# EAGLE design DRV2605 (EAGLE 9.1.3)

## Sheet 1 of 2
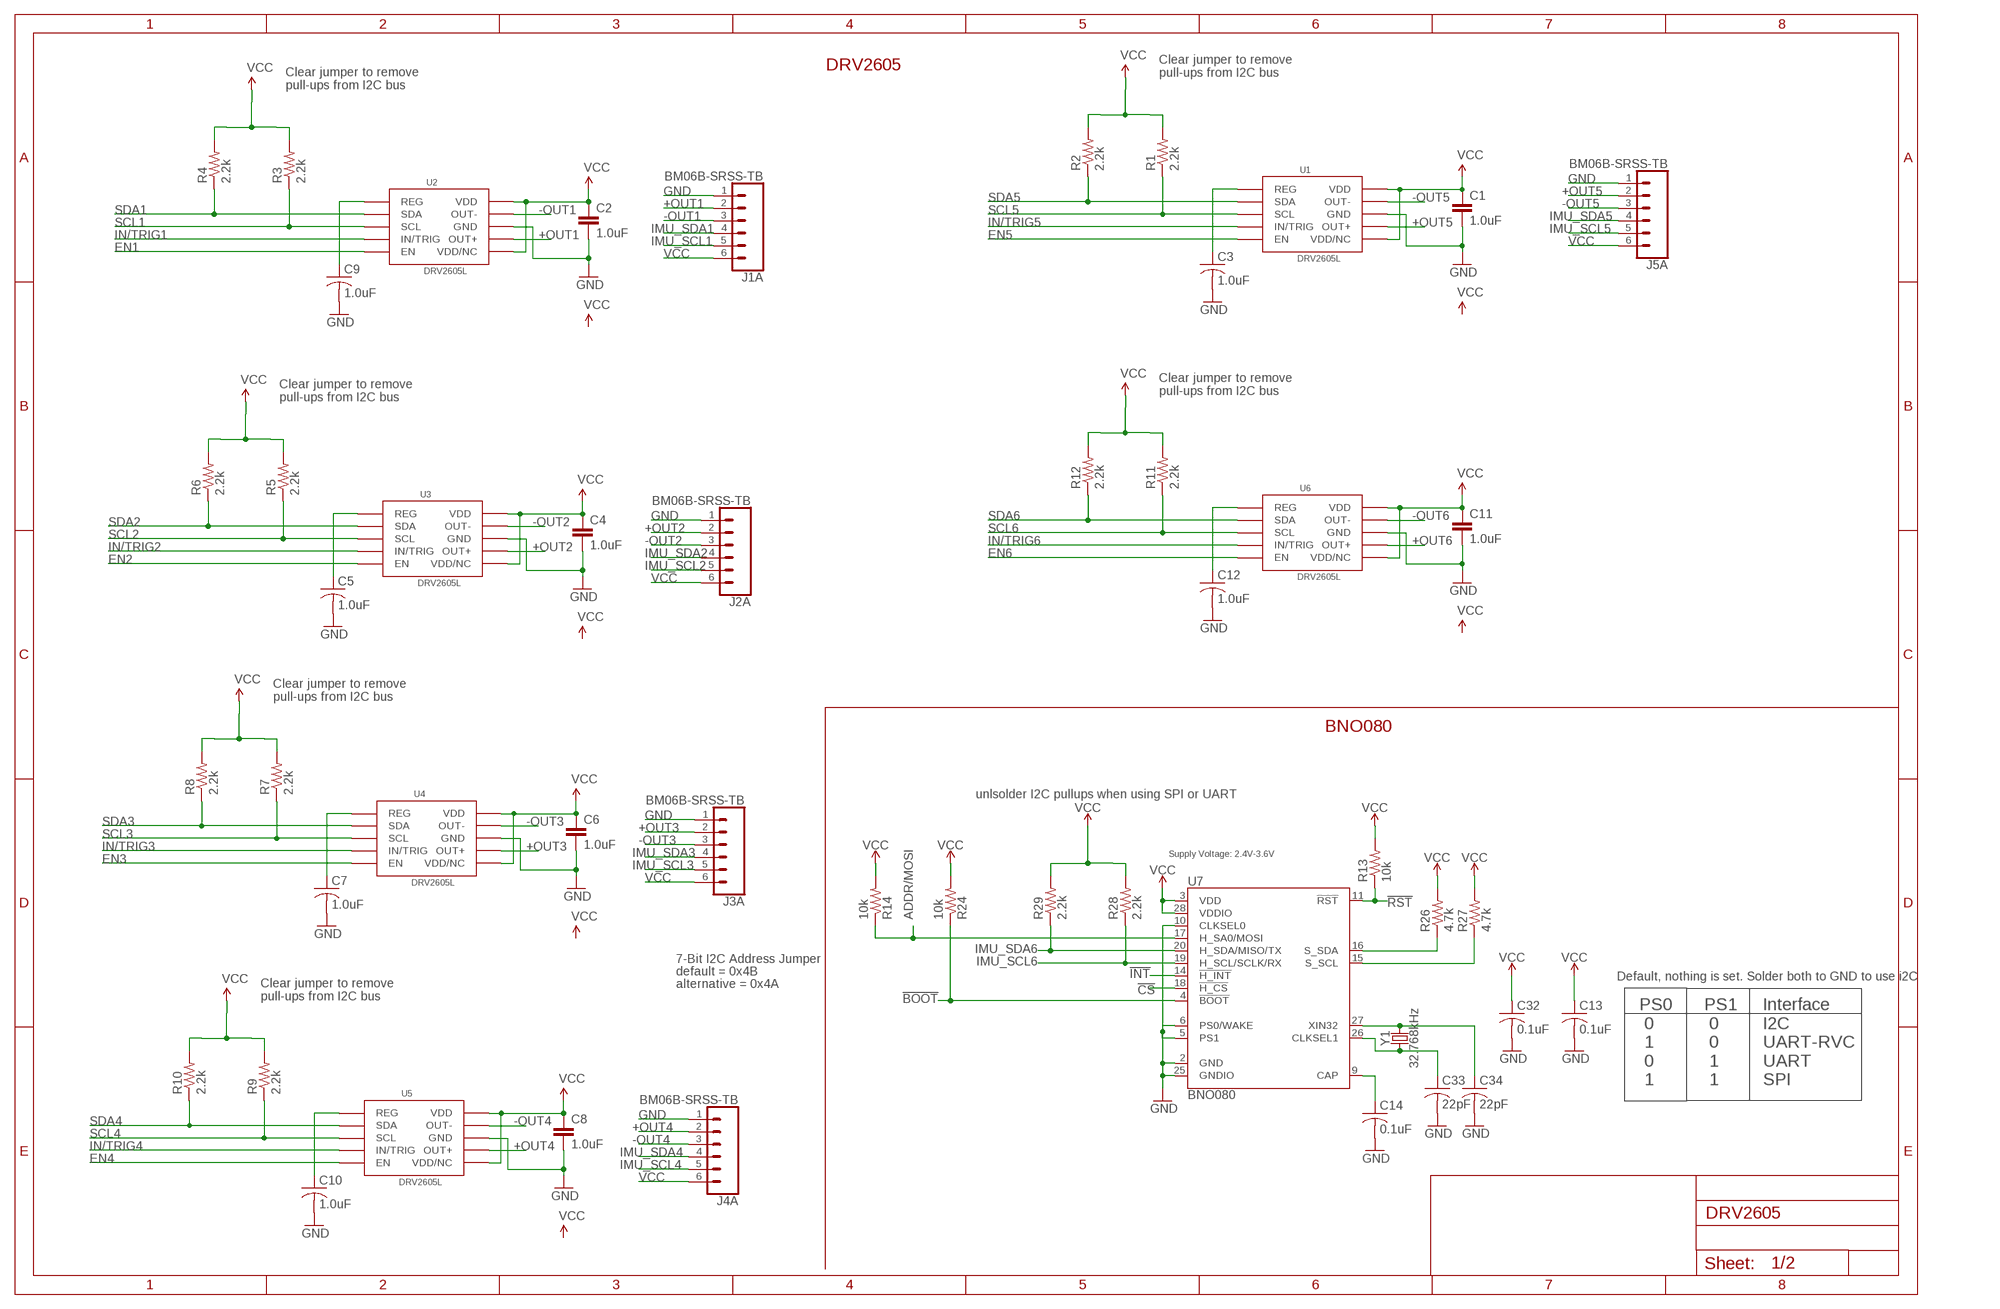
[diagram p0: schematic, sheet 1]

### Parts
C1  1.0uF  1.0UF-16V-10%(0402)  [0402-CAP]
C2  1.0uF  1.0UF-16V-10%(0402)  [0402-CAP]
C3  1.0uF  C-USC0402  [C0402]
C4  1.0uF  1.0UF-16V-10%(0402)  [0402-CAP]
C5  1.0uF  C-USC0402  [C0402]
C6  1.0uF  1.0UF-16V-10%(0402)  [0402-CAP]
C7  1.0uF  C-USC0402  [C0402]
C8  1.0uF  1.0UF-16V-10%(0402)  [0402-CAP]
C9  1.0uF  C-USC0402  [C0402]
C10  1.0uF  C-USC0402  [C0402]
C11  1.0uF  1.0UF-16V-10%(0402)  [0402-CAP]
C12  1.0uF  C-USC0402  [C0402]
C13  0.1uF  C-USC0402  [C0402]
C14  0.1uF  C-USC0402  [C0402]
C32  0.1uF  C-USC0402  [C0402]
C33  22pF  C-USC0402  [C0402]
C34  22pF  C-USC0402  [C0402]
J1  BM06B-SRSS-TB  JST_6_PIN_HORIZONTAL  [JST-6-SMD-HORI-1.0MM]
J2  BM06B-SRSS-TB  JST_6_PIN_HORIZONTAL  [JST-6-SMD-HORI-1.0MM]
J3  BM06B-SRSS-TB  JST_6_PIN_HORIZONTAL  [JST-6-SMD-HORI-1.0MM]
J4  BM06B-SRSS-TB  JST_6_PIN_HORIZONTAL  [JST-6-SMD-HORI-1.0MM]
J5  BM06B-SRSS-TB  JST_6_PIN_HORIZONTAL  [JST-6-SMD-HORI-1.0MM]
R1  2.2k  2.2KOHM-1/10W-1%(0603)  [0603-RES]
R2  2.2k  2.2KOHM-1/10W-1%(0603)  [0603-RES]
R3  2.2k  2.2KOHM-1/10W-1%(0603)  [0603-RES]
R4  2.2k  2.2KOHM-1/10W-1%(0603)  [0603-RES]
R5  2.2k  2.2KOHM-1/10W-1%(0603)  [0603-RES]
R6  2.2k  2.2KOHM-1/10W-1%(0603)  [0603-RES]
R7  2.2k  2.2KOHM-1/10W-1%(0603)  [0603-RES]
R8  2.2k  2.2KOHM-1/10W-1%(0603)  [0603-RES]
R9  2.2k  2.2KOHM-1/10W-1%(0603)  [0603-RES]
R10  2.2k  2.2KOHM-1/10W-1%(0603)  [0603-RES]
R11  2.2k  2.2KOHM-1/10W-1%(0603)  [0603-RES]
R12  2.2k  2.2KOHM-1/10W-1%(0603)  [0603-RES]
R13  10k  R-US_R0402  [R0402]
R14  10k  R-US_R0402  [R0402]
R24  10k  R-US_R0402  [R0402]
R26  4.7k  R-US_R0402  [R0402]
R27  4.7k  R-US_R0402  [R0402]
R28  2.2k  R-US_R0402  [R0402]
R29  2.2k  R-US_R0402  [R0402]
U1  DRV2605L  [VSSOP-10]
U2  DRV2605L  [VSSOP-10]
U3  DRV2605L  [VSSOP-10]
U4  DRV2605L  [VSSOP-10]
U5  DRV2605L  [VSSOP-10]
U6  DRV2605L  [VSSOP-10]
U7  BNO080  [LGA-28]
Y1  32.768kHz  CRYSTAL-32.768KHZSMD-3.2X1.5  [CRYSTAL-SMD-3.2X1.5MM]

### Nets
!BOOT: R24.1 U7.4(!BOOT)
!CS: U7.18(!H_CS)
!INT: U7.14(!H_INT)
!RST: R13.1 U7.11(!RST)
+OUT1: J1.2 U2.P$7(OUT+)
+OUT2: J2.2 U3.P$7(OUT+)
+OUT3: J3.2 U4.P$7(OUT+)
+OUT4: J4.2 U5.P$7(OUT+)
+OUT5: J5.2 U1.P$7(OUT+)
+OUT6: U6.P$7(OUT+) ; also sheet 2
-OUT1: J1.3 U2.P$9(OUT-)
-OUT2: J2.3 U3.P$9(OUT-)
-OUT3: J3.3 U4.P$9(OUT-)
-OUT4: J4.3 U5.P$9(OUT-)
-OUT5: J5.3 U1.P$9(OUT-)
-OUT6: U6.P$9(OUT-) ; also sheet 2
ADDR/MOSI: R14.1 U7.17(H_SA0/MOSI)
CAP: C14.1 U7.9(CAP)
EN1: U2.P$5(EN) ; also sheet 2
EN2: U3.P$5(EN) ; also sheet 2
EN3: U4.P$5(EN) ; also sheet 2
EN4: U5.P$5(EN) ; also sheet 2
EN5: U1.P$5(EN) ; also sheet 2
EN6: U6.P$5(EN) ; also sheet 2
GND: C1.2 C2.2 C3.2 C4.2 C5.2 C6.2 C7.2 C8.2 C9.2 C10.2 C11.2 C12.2 C13.2 C14.2 C32.2 C33.2 C34.2 J1.1 J2.1 J3.1 J4.1 J5.1 U1.P$8(GND) U2.P$8(GND) U3.P$8(GND) U4.P$8(GND) U5.P$8(GND) U6.P$8(GND) U7.2(GND) U7.5(PS1) U7.6(PS0/WAKE) U7.10(CLKSEL0) U7.25(GNDIO) ; also sheet 2
IMU_SCL1: J1.5 ; also sheet 2
IMU_SCL2: J2.5 ; also sheet 2
IMU_SCL3: J3.5 ; also sheet 2
IMU_SCL4: J4.5 ; also sheet 2
IMU_SCL5: J5.5 ; also sheet 2
IMU_SCL6: R28.1 U7.19(H_SCL/SCLK/RX) ; also sheet 2
IMU_SDA1: J1.4 ; also sheet 2
IMU_SDA2: J2.4 ; also sheet 2
IMU_SDA3: J3.4 ; also sheet 2
IMU_SDA4: J4.4 ; also sheet 2
IMU_SDA5: J5.4 ; also sheet 2
IMU_SDA6: R29.1 U7.20(H_SDA/MISO/TX) ; also sheet 2
IN/TRIG1: U2.P$4(IN/TRIG) ; also sheet 2
IN/TRIG2: U3.P$4(IN/TRIG) ; also sheet 2
IN/TRIG3: U4.P$4(IN/TRIG) ; also sheet 2
IN/TRIG4: U5.P$4(IN/TRIG) ; also sheet 2
IN/TRIG5: U1.P$4(IN/TRIG) ; also sheet 2
IN/TRIG6: U6.P$4(IN/TRIG) ; also sheet 2
N$1: C3.1 U1.P$1(REG)
N$4: C12.1 U6.P$1(REG)
N$7: C34.1 U7.27(XIN32) Y1.P$2
N$10: C9.1 U2.P$1(REG)
N$13: C5.1 U3.P$1(REG)
N$14: C33.1 U7.26(CLKSEL1) Y1.P$1
N$16: C7.1 U4.P$1(REG)
N$19: C10.1 U5.P$1(REG)
S_SCL: R27.1 U7.15(S_SCL)
S_SDA: R26.1 U7.16(S_SDA)
SCL1: R3.1 U2.P$2(SCL) ; also sheet 2
SCL2: R5.1 U3.P$2(SCL) ; also sheet 2
SCL3: R7.1 U4.P$2(SCL) ; also sheet 2
SCL4: R9.1 U5.P$2(SCL) ; also sheet 2
SCL5: R1.1 U1.P$2(SCL) ; also sheet 2
SCL6: R11.1 U6.P$2(SCL) ; also sheet 2
SDA1: R4.1 U2.P$3(SDA) ; also sheet 2
SDA2: R6.1 U3.P$3(SDA) ; also sheet 2
SDA3: R8.1 U4.P$3(SDA) ; also sheet 2
SDA4: R10.1 U5.P$3(SDA) ; also sheet 2
SDA5: R2.1 U1.P$3(SDA) ; also sheet 2
SDA6: R12.1 U6.P$3(SDA) ; also sheet 2
VCC: C1.1 C2.1 C4.1 C6.1 C8.1 C11.1 C13.1 C32.1 J1.6 J2.6 J3.6 J4.6 J5.6 R1.2 R2.2 R3.2 R4.2 R5.2 R6.2 R7.2 R8.2 R9.2 R10.2 R11.2 R12.2 R13.2 R14.2 R24.2 R26.2 R27.2 R28.2 R29.2 U1.P$6(VDD/NC) U1.P$10(VDD) U2.P$6(VDD/NC) U2.P$10(VDD) U3.P$6(VDD/NC) U3.P$10(VDD) U4.P$6(VDD/NC) U4.P$10(VDD) U5.P$6(VDD/NC) U5.P$10(VDD) U6.P$6(VDD/NC) U6.P$10(VDD) U7.3(VDD) U7.28(VDDIO) ; also sheet 2
Unconnected: J1.M1 J1.M2 J2.M1 J2.M2 J3.M1 J3.M2 J4.M1 J4.M2 J5.M1 J5.M2

### Notes on the sheet
- DRV2605
- Clear jumper to remove
  pull-ups from I2C bus
- Clear jumper to remove
  pull-ups from I2C bus
- Clear jumper to remove
  pull-ups from I2C bus
- Clear jumper to remove
  pull-ups from I2C bus
- Clear jumper to remove
  pull-ups from I2C bus
- BNO080
- unlsolder I2C pullups when using SPI or UART
- Supply Voltage: 2.4V-3.6V
- 7-Bit I2C Address Jumper
- default = 0x4B
- Default, nothing is set. Solder both to GND to use i2C
- alternative = 0x4A
- Clear jumper to remove
  pull-ups from I2C bus
- PS0
   0
   1
   0
   1
- PS1
   0
   0
   1
   1
- Interface
  I2C
  UART-RVC
  UART
  SPI

## Sheet 2 of 2
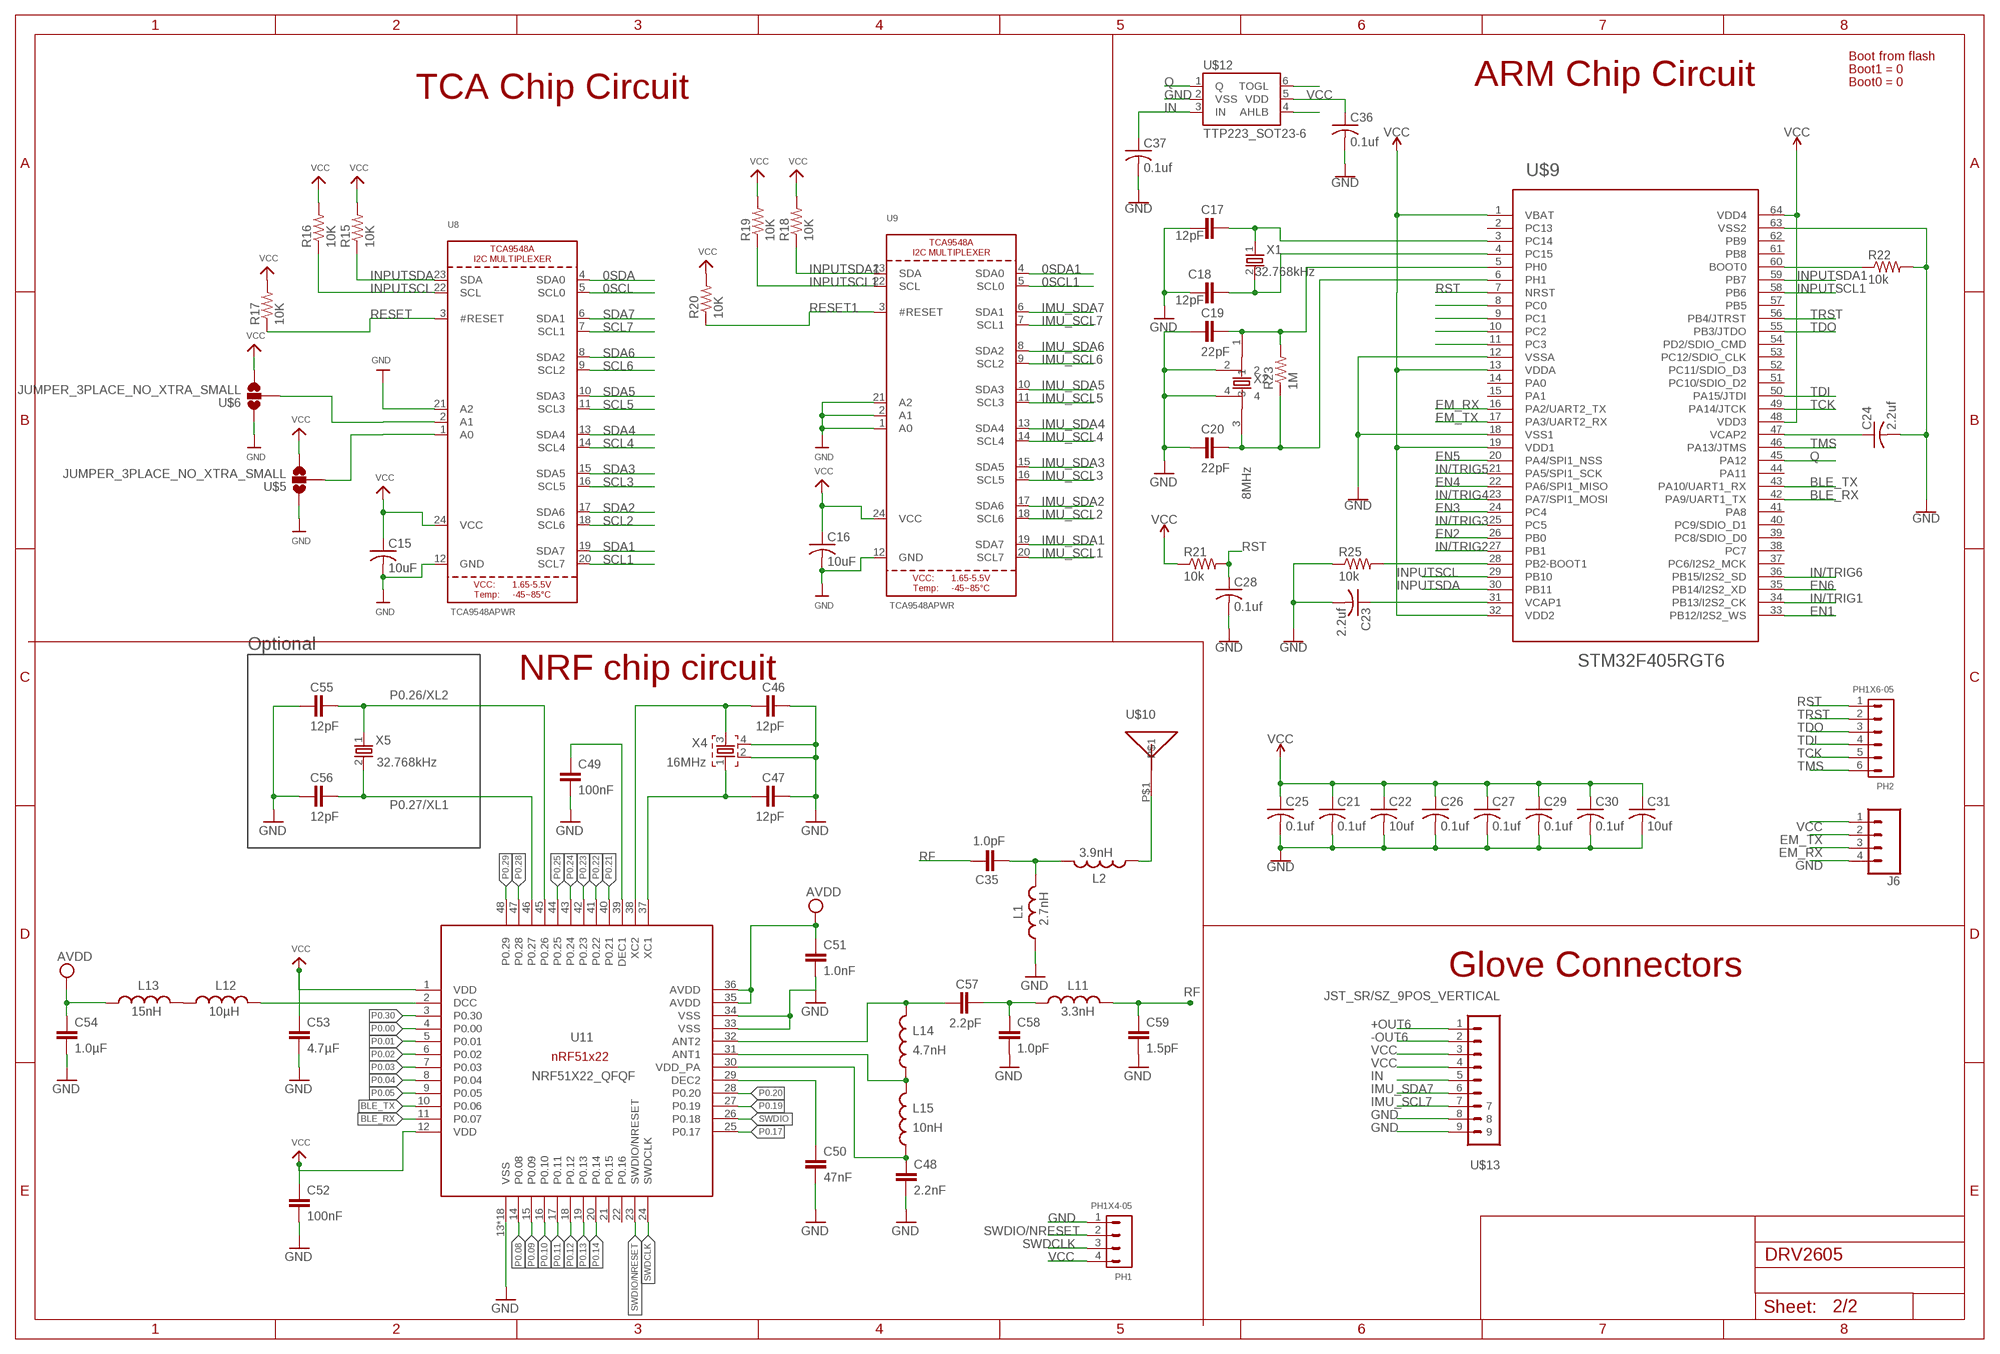
[diagram p1: schematic, sheet 2]

### Parts
C15  10uF  C-USC0402  [C0402]
C16  10uF  C-USC0402  [C0402]
C17  12pF  CAPACITOR_0402_N  [RESC0402_N]
C18  12pF  CAPACITOR_0402_N  [RESC0402_N]
C19  22pF  CAPACITOR_0402_N  [RESC0402_N]
C20  22pF  CAPACITOR_0402_N  [RESC0402_N]
C21  0.1uf  C-USC0402  [C0402]
C22  10uf  C-USC0402  [C0402]
C23  2.2uf  C-USC0402  [C0402]
C24  2.2uf  C-USC0402  [C0402]
C25  0.1uf  C-USC0402  [C0402]
C26  0.1uf  C-USC0402  [C0402]
C27  0.1uf  C-USC0402  [C0402]
C28  0.1uf  C-USC0402  [C0402]
C29  0.1uf  C-USC0402  [C0402]
C30  0.1uf  C-USC0402  [C0402]
C31  10uf  C-USC0402  [C0402]
C35  1.0pF  CAPACITOR_0402_N  [RESC0402_N]
C36  0.1uf  C-USC0402  [C0402]
C37  0.1uf  C-USC0402  [C0402]
C46  12pF  CAPACITOR_0402_N  [RESC0402_N]
C47  12pF  CAPACITOR_0402_N  [RESC0402_N]
C48  2.2nF  CAPACITOR_0402_N  [RESC0402_N]
C49  100nF  CAPACITOR_0402_N  [RESC0402_N]
C50  47nF  CAPACITOR_0402_N  [RESC0402_N]
C51  1.0nF  CAPACITOR_0402_N  [RESC0402_N]
C52  100nF  CAPACITOR_0402_N  [RESC0402_N]
C53  4.7µF  CAPACITOR_0603_N  [RESC0603_N]
C54  1.0µF  CAPACITOR_0603_N  [RESC0603_N]
C55  12pF  CAPACITOR_0402_N  [RESC0402_N]
C56  12pF  CAPACITOR_0402_N  [RESC0402_N]
C57  2.2pF  CAPACITOR_0402_N  [RESC0402_N]
C58  1.0pF  CAPACITOR_0402_N  [RESC0402_N]
C59  1.5pF  CAPACITOR_0402_N  [RESC0402_N]
J6  CONN_04  [1X04]
L1  2.7nH  INDUCTOR_0402_N  [RESC0402_N]
L2  3.9nH  INDUCTOR_0402_N  [RESC0402_N]
L11  3.3nH  INDUCTOR_0402_N  [RESC0402_N]
L12  10µH  INDUCTOR_0603_N  [RESC0603_N]
L13  15nH  INDUCTOR_0402_N  [RESC0402_N]
L14  4.7nH  INDUCTOR_0402_N  [RESC0402_N]
L15  10nH  INDUCTOR_0402_N  [RESC0402_N]
PH1  PH1X4-05  [PH005-1-4]
PH2  PH1X6-05  [PH005-1-6]
R15  10K  R-US_R0402  [R0402]
R16  10K  R-US_R0402  [R0402]
R17  10K  R-US_R0402  [R0402]
R18  10K  R-US_R0402  [R0402]
R19  10K  R-US_R0402  [R0402]
R20  10K  R-US_R0402  [R0402]
R21  10k  R-US_R0402  [R0402]
R22  10k  R-US_R0402  [R0402]
R23  1M  R-US_R0402  [R0402]
R25  10k  R-US_R0402  [R0402]
U8  TCA9548APWR  TCA9548A  [TSSOP24]
U9  TCA9548APWR  TCA9548A  [TSSOP24]
U11  NRF51X22_QFQF  [QFN40P600X600X90-48_N]
U$5  JUMPER_3PLACE_NO_XTRA_SMALL  [XTRA_SMALL_JUMPER_3_NO]
U$6  JUMPER_3PLACE_NO_XTRA_SMALL  [XTRA_SMALL_JUMPER_3_NO]
U$9  STM32F405RGT6  STM32F405RG  [TQFP64]
U$10  ANT_2450AT18B100E  [2450AT18B100E]
U$12  TTP223_SOT23-6  [SOT23-6]
U$13  JST_SR/SZ_9POS_VERTICAL  [JST_SR/SZ_VERTICA_9POS]
X1  32.768kHz  XTAL_32KHZ  [XTAL_3215_N]
X2  8MHz  CRYSTAL_5X3.2MM_4PAD  [CRYSTAL-SMD-5X3.2-4PAD]
X4  16MHz  XTAL_32MHZ  [BT-XTAL_2016_N]
X5  32.768kHz  XTAL_32KHZ  [XTAL_3215_N]

### Nets
0SCL: U8.5(SCL0)
0SCL1: U9.5(SCL0)
0SDA: U8.4(SDA0)
0SDA1: U9.4(SDA0)
+OUT6: U$13.1 ; also sheet 1
-OUT6: U$13.2 ; also sheet 1
AVDD: C51.1 C54.1 L13.1 U11.35(AVDD) U11.36(AVDD)
BLE_RX: U11.11(P0.07) U$9.42(PA9/UART1_TX)
BLE_TX: U11.10(P0.06) U$9.43(PA10/UART1_RX)
EM_RX: J6.3 U$9.16(PA2/UART2_TX)
EM_TX: J6.2 U$9.17(PA3/UART2_RX)
EN1: U$9.33(PB12/I2S2_WS) ; also sheet 1
EN2: U$9.26(PB0) ; also sheet 1
EN3: U$9.24(PC4) ; also sheet 1
EN4: U$9.22(PA6/SPI1_MISO) ; also sheet 1
EN5: U$9.20(PA4/SPI1_NSS) ; also sheet 1
EN6: U$9.35(PB14/I2S2_XD) ; also sheet 1
GND: C15.2 C16.2 C17.1 C18.1 C19.1 C20.1 C21.2 C22.2 C23.2 C24.2 C25.2 C26.2 C27.2 C28.2 C29.2 C30.2 C31.2 C36.2 C37.2 C46.2 C47.2 C48.2 C49.2 C50.2 C51.2 C52.2 C53.2 C54.2 C55.1 C56.1 C58.2 C59.2 J6.4 L1.1 PH1.1 R22.2 R25.1 U8.12(GND) U8.21(A2) U9.1(A0) U9.2(A1) U9.12(GND) U9.21(A2) U11.13(VSS) U11.33(VSS) U11.34(VSS) U11.PAD(VSS) U11.PAD@VIA01(VSS) U11.PAD@VIA02(VSS) U11.PAD@VIA03(VSS) U11.PAD@VIA04(VSS) U11.PAD@VIA05(VSS) U11.PAD@VIA06(VSS) U11.PAD@VIA07(VSS) U11.PAD@VIA08(VSS) U11.PAD@VIA09(VSS) U11.PAD@VIA10(VSS) U11.PAD@VIA11(VSS) U11.PAD@VIA12(VSS) U11.PAD@VIA13(VSS) U11.PAD@VIA14(VSS) U11.PAD@VIA15(VSS) U11.PAD@VIA16(VSS) U$5.1 U$6.1 U$9.12(VSSA) U$9.18(VSS1) U$9.63(VSS2) U$12.2(VSS) U$13.8 U$13.9 X2.2 X2.4 X4.2 X4.4 ; also sheet 1
IMU_SCL1: U9.20(SCL7) ; also sheet 1
IMU_SCL2: U9.18(SCL6) ; also sheet 1
IMU_SCL3: U9.16(SCL5) ; also sheet 1
IMU_SCL4: U9.14(SCL4) ; also sheet 1
IMU_SCL5: U9.11(SCL3) ; also sheet 1
IMU_SCL6: U9.9(SCL2) ; also sheet 1
IMU_SCL7: U9.7(SCL1) U$13.7
IMU_SDA1: U9.19(SDA7) ; also sheet 1
IMU_SDA2: U9.17(SDA6) ; also sheet 1
IMU_SDA3: U9.15(SDA5) ; also sheet 1
IMU_SDA4: U9.13(SDA4) ; also sheet 1
IMU_SDA5: U9.10(SDA3) ; also sheet 1
IMU_SDA6: U9.8(SDA2) ; also sheet 1
IMU_SDA7: U9.6(SDA1) U$13.6
IN: C37.1 U$12.3(IN) U$13.5
IN/TRIG1: U$9.34(PB13/I2S2_CK) ; also sheet 1
IN/TRIG2: U$9.27(PB1) ; also sheet 1
IN/TRIG3: U$9.25(PC5) ; also sheet 1
IN/TRIG4: U$9.23(PA7/SPI1_MOSI) ; also sheet 1
IN/TRIG5: U$9.21(PA5/SPI1_SCK) ; also sheet 1
IN/TRIG6: U$9.36(PB15/I2S2_SD) ; also sheet 1
INPUTSCL: R16.1 U8.22(SCL) U$9.29(PB10)
INPUTSCL1: R19.1 U9.22(SCL) U$9.58(PB6)
INPUTSDA: R15.1 U8.23(SDA) U$9.30(PB11)
INPUTSDA1: R18.1 U9.23(SDA) U$9.59(PB7)
N$2: R25.2 U$9.28(PB2-BOOT1)
N$3: R22.1 U$9.60(BOOT0)
N$5: C23.1 U$9.31(VCAP1)
N$6: C24.1 U$9.47(VCAP2)
N$8: U$9.8(PC0)
N$9: U$9.9(PC1)
N$11: U$9.10(PC2)
N$12: U$9.11(PC3)
N$15: C35.1 L1.2 L2.2
N$17: L2.1 U$10.P$1
N$22: U$12.6(TOGL)
N$24: U$12.4(AHLB)
N$27: U8.1(A0) U$5.2
N$30: U8.2(A1) U$6.2
N$33: C46.1 U11.38(XC2) X4.3
N$34: L12.1 L13.2
N$35: L12.2 U11.2(DCC)
N$36: C50.1 U11.29(DEC2)
N$37: C49.1 U11.39(DEC1)
N$38: L14.1 L15.2 U11.31(ANT1)
N$39: C48.1 L15.1 U11.30(VDD_PA)
N$40: C57.1 L14.2 U11.32(ANT2)
N$41: C57.2 C58.1 L11.1
P0.00: U11.4(P0.00)
P0.01: U11.5(P0.01)
P0.02: U11.6(P0.02)
P0.03: U11.7(P0.03)
P0.04: U11.8(P0.04)
P0.05: U11.9(P0.05)
P0.08: U11.14(P0.08)
P0.09: U11.15(P0.09)
P0.10: U11.16(P0.10)
P0.11: U11.17(P0.11)
P0.12: U11.18(P0.12)
P0.13: U11.19(P0.13)
P0.14: U11.20(P0.14)
P0.17: U11.25(P0.17)
P0.19: U11.27(P0.19)
P0.20: U11.28(P0.20)
P0.21: U11.40(P0.21)
P0.22: U11.41(P0.22)
P0.23: U11.42(P0.23)
P0.24: U11.43(P0.24)
P0.25: U11.44(P0.25)
P0.26/XL2: C55.2 U11.45(P0.26) X5.1
P0.27/XL1: C56.2 U11.46(P0.27) X5.2
P0.28: U11.47(P0.28)
P0.29: U11.48(P0.29)
P0.30: U11.3(P0.30)
PC14: C17.2 U$9.3(PC14) X1.1
PC15: C18.2 U$9.4(PC15) X1.2
PH0: C19.2 R23.2 U$9.5(PH0) X2.1
PH1: C20.2 R23.1 U$9.6(PH1) X2.3
Q: U$9.45(PA12) U$12.1(Q)
RESET: R17.1 U8.3(#RESET)
RESET1: R20.1 U9.3(#RESET)
RF: C35.2 C59.1 L11.2
RST: C28.1 PH2.1 R21.2 U$9.7(NRST)
SCL1: U8.20(SCL7) ; also sheet 1
SCL2: U8.18(SCL6) ; also sheet 1
SCL3: U8.16(SCL5) ; also sheet 1
SCL4: U8.14(SCL4) ; also sheet 1
SCL5: U8.11(SCL3) ; also sheet 1
SCL6: U8.9(SCL2) ; also sheet 1
SCL7: U8.7(SCL1)
SDA1: U8.19(SDA7) ; also sheet 1
SDA2: U8.17(SDA6) ; also sheet 1
SDA3: U8.15(SDA5) ; also sheet 1
SDA4: U8.13(SDA4) ; also sheet 1
SDA5: U8.10(SDA3) ; also sheet 1
SDA6: U8.8(SDA2) ; also sheet 1
SDA7: U8.6(SDA1)
SWDCLK: PH1.3 U11.24(SWDCLK)
SWDIO: U11.26(P0.18)
SWDIO/NRESET: PH1.2 U11.23(SWDIO/NRESET)
TCK: PH2.5 U$9.49(PA14/JTCK)
TDI: PH2.4 U$9.50(PA15/JTDI)
TDO: PH2.3 U$9.55(PB3/JTDO)
TMS: PH2.6 U$9.46(PA13/JTMS)
TRST: PH2.2 U$9.56(PB4/JTRST)
VCC: C15.1 C16.1 C21.1 C22.1 C25.1 C26.1 C27.1 C29.1 C30.1 C31.1 C36.1 C52.1 C53.1 J6.1 PH1.4 R15.2 R16.2 R17.2 R18.2 R19.2 R20.2 R21.1 U8.24(VCC) U9.24(VCC) U11.1(VDD) U11.12(VDD) U$5.3 U$6.3 U$9.1(VBAT) U$9.13(VDDA) U$9.19(VDD1) U$9.32(VDD2) U$9.48(VDD3) U$9.64(VDD4) U$12.5(VDD) U$13.3 U$13.4 ; also sheet 1
X2: C47.1 U11.37(XC1) X4.1
Unconnected: U11.21(P0.15) U11.22(P0.16) U$9.2(PC13) U$9.14(PA0) U$9.15(PA1) U$9.37(PC6/I2S2_MCK) U$9.38(PC7) U$9.39(PC8/SDIO_D0) U$9.40(PC9/SDIO_D1) U$9.41(PA8) U$9.44(PA11) U$9.51(PC10/SDIO_D2) U$9.52(PC11/SDIO_D3) U$9.53(PC12/SDIO_CLK) U$9.54(PD2/SDIO_CMD) U$9.57(PB5) U$9.61(PB8) U$9.62(PB9)

### Notes on the sheet
- Boot from flash
- Boot1 = 0
- ARM Chip Circuit | Boot0 = 0
- TCA Chip Circuit
- Optional
- NRF chip circuit
- Glove Connectors

## Library data of the parts
C1 C2 C4 C6 C8 C11 = SparkFun-Capacitors:1.0UF-16V-10%(0402); PROD_ID: CAP-12417
C3 C5 C7 C9 C10 C12-C14 C21-C34 C36 C37 = rcl:C-US: CAPACITOR, American symbol; SPICEPREFIX: C
C15 C16 = resistor:C-US: CAPACITOR, American symbol
C17-C20 C35 C46-C59 = Nordic_nRF:CAPACITOR: Generic chip capacitor
J1-J5 = SparkFun-Connectors:JST_6_PIN_HORIZONTAL: JST 6 pin horizontal connector JST-SH type. Here is the connector we sell at SparkFun: name <link> (XXX-00000) Datasheet <http://www.sparkfun.com/datasheets/GPS/EM406-SMDConnector-eSH.pdf> It was used on these SparkFun products: name <link> (XXX-00000) name <link> (XXX-00000); PROD_ID: XXX-00000
J6 = SparkFun-Connectors:CONN_04: Multi connection point. Often used as Generic Header-pin footprint for 0.1 inch spaced/style header connections On any of the 0.1 inch spaced packages, you can populate with these: Break Away Headers - Straight <https://www.sparkfun.com/products/116> (PRT-00116) Break Away Male Headers - Right Angle <https://www.sparkfun.com/products/553> (PRT-00553) Female Headers <https://www.sparkfun.com/products/115> (PRT-00115) Break Away Headers - Machine Pin <https://www.sparkfun.com/products/117> (PRT-00117) Break Away Female Headers - Swiss Machine Pin <https://www.sparkfun.com/products/743> (PRT-00743) For SCREWTERMINALS and SPRING TERMINALS visit here: Screw Terimnals on SparkFun.com <https://www.sparkfun.com/search/results?term=Screw+Terminals> (5mm/3.5mm/2.54mm spacing) This device is also useful as a general connection point to wire up your design to another part of your project. Our various solder wires solder well into these plated through hole pads. Hook-Up Wire - Assortment (Stranded, 22 AWG) <https://www.sparkfun.com/products/11375> (PRT-11375) Hook-Up Wire - Assortment (Solid Core, 22 AWG) <https://www.sparkfun.com/products/11367> (PRT-11367) View the entire wire category on our website here <https://www.sparkfun.com/categories/141> Special notes: Molex polarized connector foot print use with SKU : PRT-08231 with associated crimp pins and housings. 1MM SMD Version SKU: PRT-10208; PROD_ID: CONN-09696
L1 L2 L11-L15 = Nordic_nRF:INDUCTOR: Generic chip inductor
PH1 = pel_hdr:PH1X4
PH2 = pel_hdr:PH1X6
R1-R12 = SparkFun-Resistors:2.2KOHM-1/10W-1%(0603): RES-08272; PROD_ID: RES-08272
R13-R20 R24 R26-R29 = rcl:R-US_: RESISTOR, American symbol; SPICEPREFIX: R
R21-R23 R25 = resistor:R-US_: RESISTOR, American symbol
U1-U6 = SparkFun-PowerIC:DRV2605L; PROD_ID: IC-13504
U7 = SparkFun-IC-Special-Function:BNO080: Hillcrest Labs BNO080 - High Precision IMU (VR) The VR IMU uses the impressive BNO080 IMU. This IC has a combination triple axis accelerometer/gyro/magnetometer packaged with an ARM Cortex M0+ running powerful algorithms. The BNO080 Inertial Measurement Unit (IMU) produces accurate rotation vector headings, excellently suited for VR and other heading applications with a static rotation error of 2 degrees or less. It’s what we’ve been waiting for: all the sensor data is combined and drift corrected into meaningful, accurate IMU information. SparkFun Products: VR IMU (BNO080) <https://www.sparkfun.com/products/14618>; PROD_ID: SEN-13947
U8 U9 = microbuilder:TCA9548A: TCA9548A I2C Multiplexer
U11 = Nordic_nRF:NRF51X22_QF: nRF51x22 For devices: nRF51422 nRF51822 Features Single chip, highly flexible, 2.4 GHz multi-protocol device 32-bit ARM Cortex M0 CPU core 256kB/128kB flash + 32kB/16kB RAM Supports Bluetooth low energy protocol stacks Thread safe and run-time protected Event driven API On air compatible with nRF24L series 3 data rates (2Mbps/1Mbps/250kbps) +4dBm output power -93dBm sensitivity, Bluetooth low energy PPI system for maximum power-efficient applications and code simplification Flexible power management system with automatic power management of each peripheral Configurable I/O mapping for analog and digital I/O Applications Mobile phone accessories Wearables Beacons Rezence wireless charging monitoring PC peripherals Consumer Electronics (CE) remote controls Proximity/Alert sensors Smart Home Sports, fitness and healthcare sensors Smart RF tags Toys and electronic games Intelligent domestic appliances Industrial and commercial sensors Lighting
U$5 U$6 = yhtomit_jumpers:JUMPER_3PLACE_NO_XTRA_SMALL
U$9 = SparkFun-IC-Microcontroller:STM32F405RG: STM32F405RGT6 ARM DSP Chip used on the WAV Trigger board. IC MCU 32BIT 1MB FLASH 64LQFP Datasheet <https://cdn.sparkfun.com/datasheets/Widgets/STM32F405RGT6.pdf> SparkFun Products WAV Trigger <https://www.sparkfun.com/products/13660> (WIG-13660); PROD_ID: IC-11709
U$10 = Johanson_antennas:ANT_2450AT18B100E
U$12 = yhtomit_ICs:TTP223_SOT23-6
U$13 = yhtomit_connectors:JST_SR/SZ_9POS_VERTICAL
X1 X5 = Nordic_nRF:XTAL_32KHZ
X2 = yhtomit_XTAL:CRYSTAL_5X3.2MM_4PAD
X4 = Nordic_nRF:XTAL_32MHZ
Y1 = SparkFun-Clocks:CRYSTAL-32.768KHZ: 32.768kHz Crystal Frequency: 32.768kHz Frequency Stability: ±20ppm Load Capacitance: 12.5pF (PTH-2X6 & SMD-3.2X1.5), 6pF (SMD-2X6) SparkFun Products: SparkFun BigTime Watch Kit <https://www.sparkfun.com/products/11734> SparkFun nRF52832 Breakout <https://www.sparkfun.com/products/13990> SparkFun Real Time Clock Module <https://www.sparkfun.com/products/12708>; PROD_ID: XTAL-13062

## Net classes
1 vcc: width 0.152 mm
2 RF: clearance 0.508 mm

## Board
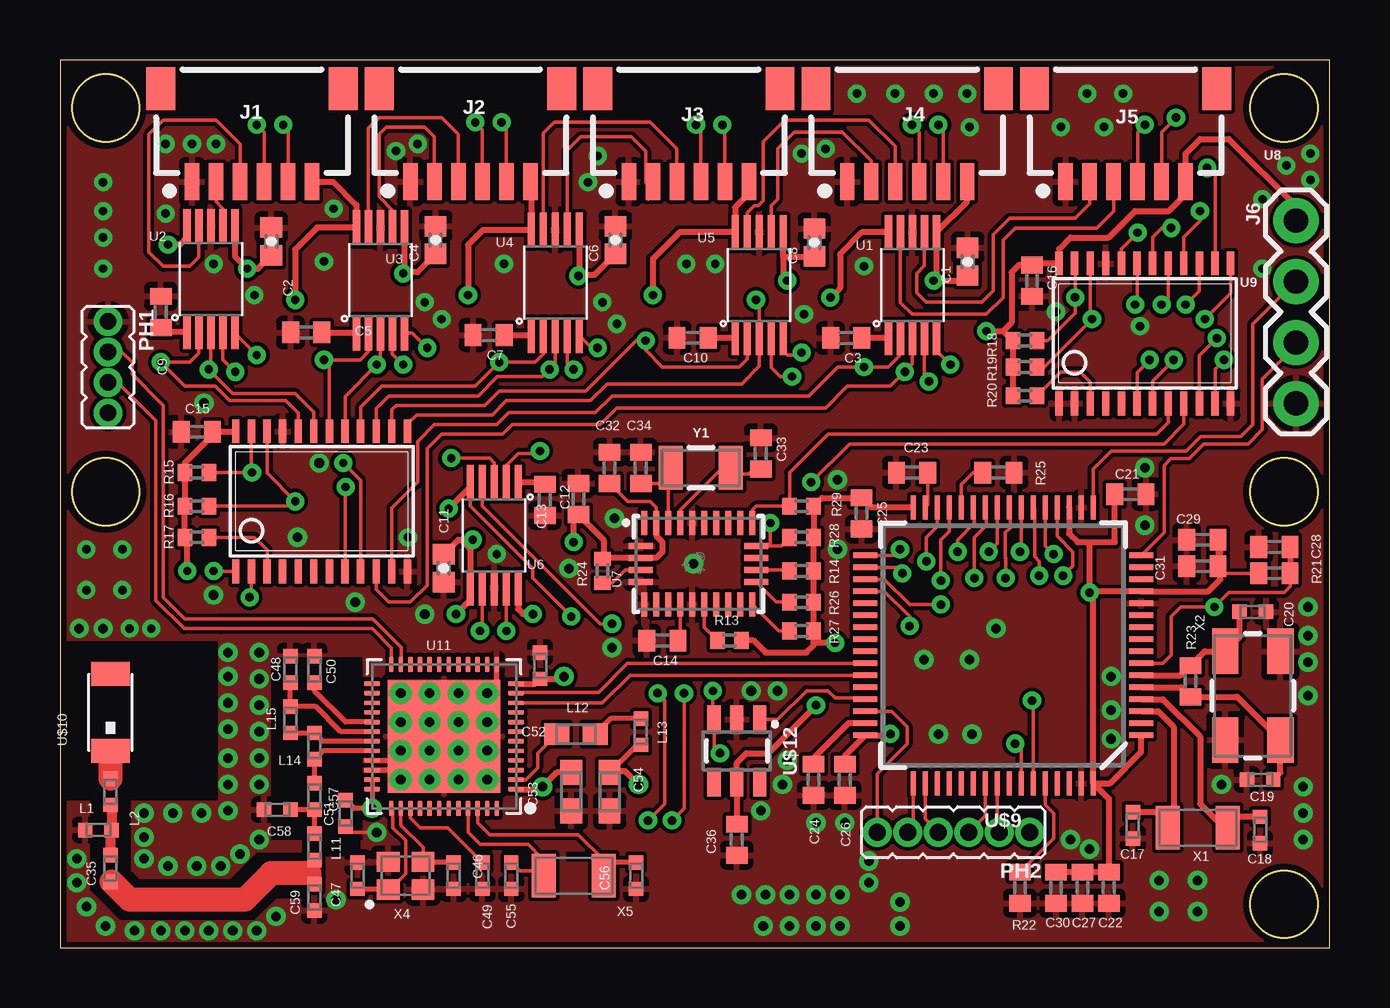
[diagram p2: board, top side]
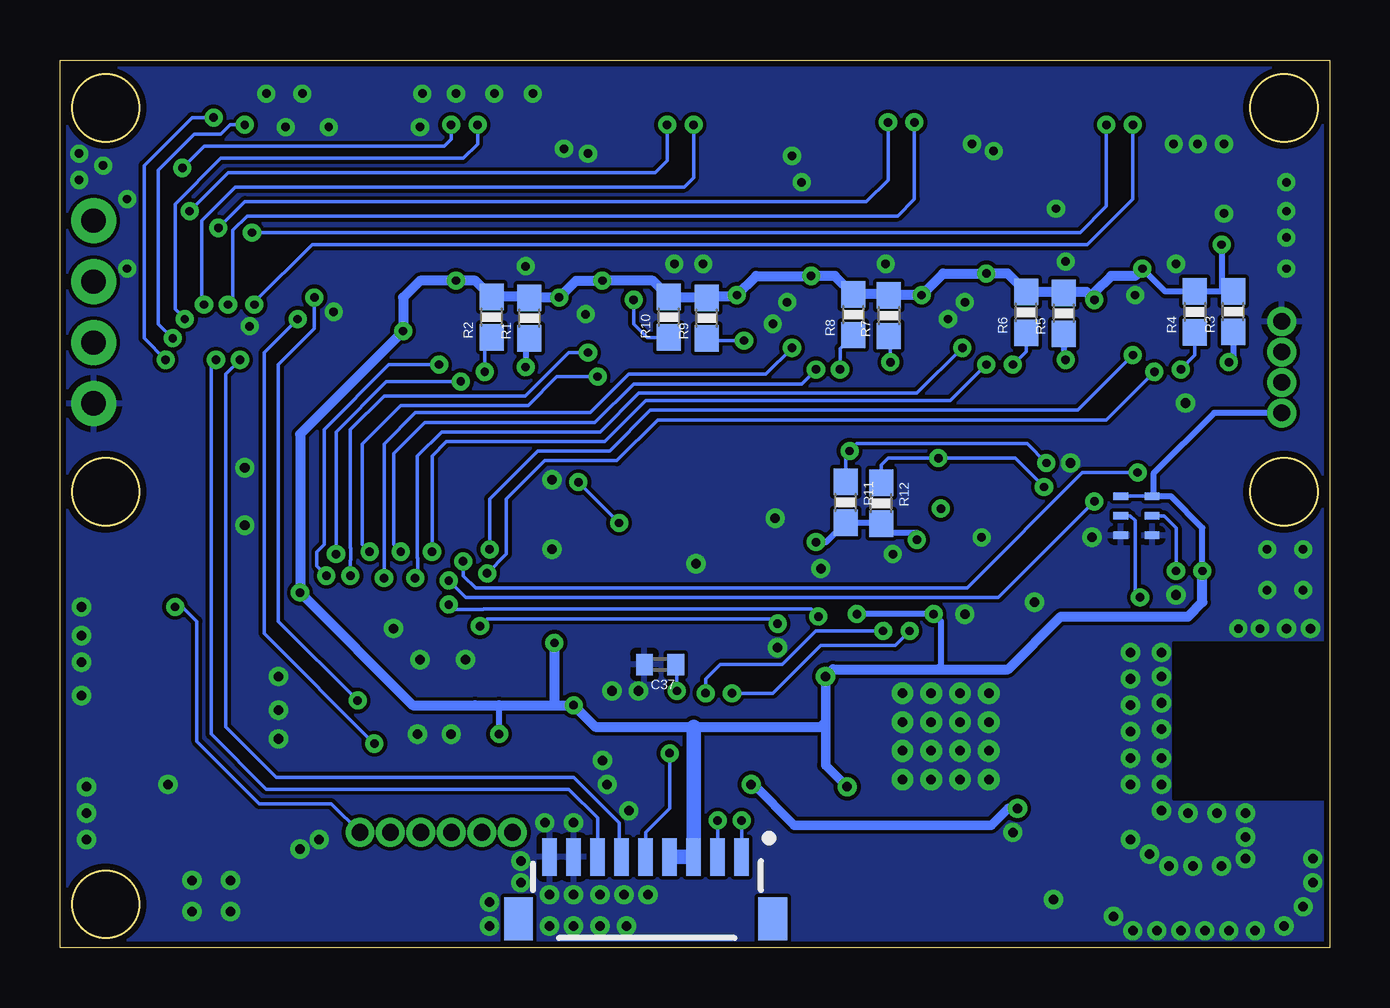
[diagram p3: board, bottom side, seen from below]

Size 52.9 x 37 mm. Coordinates in mm from the lower left corner, seen from the top.
Outline: 0,0 52.9,0 52.9,37 0,37 0,0
Outline: circle at 51,35 radius 1.4
Outline: circle at 51,1.8 radius 1.4
Outline: circle at 1.9,19 radius 1.4
Outline: circle at 1.9,35 radius 1.4
Outline: circle at 51,19 radius 1.4
Copper layers (1*16): Top 0.035mm / dielectric 1.5mm / Bottom 0.035mm
Design rules "default *": minimum track width 6mil, minimum drill 0.35mm, track to track 6mil, track to pad 6mil, pad to pad 6mil, via to via 6mil, smd to smd 6mil, copper to edge 10mil, drill to drill 6mil, minimum pad ring 10mil, minimum via ring 8mil, stop-mask expansion 4mil, vias tented up to drill 0mil, thermal gap 10mil
tRestrict: area 8.8,4.5 to 12.6,12.1; area 12.8,7.5 to 13.2,7.7; area 10.9,3.8 to 12.5,4.5; area 10.1,1.7 to 10.3,2.6; area 10.1,3.7 to 10.3,4.5; area 21.1,3.6 to 21.9,4; area 0.2,6.2 to 6.5,12.7; area 1.3,2.4 to 2.9,6.1; area 1.3,1.2 to 10.1,3.9
bRestrict: area 0.2,6.2 to 6.5,12.7

### Footprints (pad centres in the part's own frame; a part is rotated, then mirrored left to right if it is on the bottom)
0402-CAP = smd 0.85 x 0.9: 1 -0.58,0; 2 0.58,0
C0402 = smd 0.7 x 0.9: 1 -0.65,0; 2 0.65,0
RESC0402_N = smd 0.6 x 0.6: 1 -0.55,0; 2 0.55,0
RESC0603_N = smd 1.05 x 0.9: 1 -0.8,0; 2 0.8,0
JST-6-SMD-HORI-1.0MM = smd 0.6 x 1.55: 1 -2.5,-4.775; 2 -1.5,-4.775; 3 -0.5,-4.775; 4 0.5,-4.775; 5 1.5,-4.775; 6 2.5,-4.775 | smd 1.2 x 1.8: M1 -3.8,-0.9; M2 3.8,-0.9
1X04 = drill 1.016 pad 1.88: 1 0,0; 2 2.54,0; 3 5.08,0; 4 7.62,0
PH005-1-4 = drill 0.7 pad 1.016: 1 0,0; 2 1.27,0; 3 2.54,0; 4 3.81,0
PH005-1-6 = drill 0.7 pad 1.016: 1 0,0; 2 1.27,0; 3 2.54,0; 4 3.81,0; 5 5.08,0; 6 6.35,0
0603-RES = smd 1.1 x 1: 1 -0.85,0; 2 0.85,0
R0402 = smd 0.6 x 0.7: 1 -0.5,0; 2 0.5,0
R0402' = smd 0.7 x 0.9: 1 -0.65,0; 2 0.65,0
VSSOP-10 = smd 1.45 x 0.3: P$1 -1.905,1.06; P$2 -1.905,0.56; P$3 -1.905,0.06; P$4 -1.905,-0.44; P$5 -1.905,-0.94; P$6 2.495,-0.94; P$7 2.495,-0.44; P$8 2.495,0.06; P$9 2.495,0.56; P$10 2.495,1.06
LGA-28 = smd 1 x 0.25: 1 1.7,2.25; 6 -1.7,2.25; 7 -1.7,1.75; 8 -1.7,1.25; 9 -1.7,0.75; 10 -1.7,0.25; 11 -1.7,-0.25; 12 -1.7,-0.75; 13 -1.7,-1.25; 14 -1.7,-1.75; 15 -1.7,-2.25; 20 1.7,-2.25; 21 1.7,-1.75; 22 1.7,-1.25; 23 1.7,-0.75; 24 1.7,-0.25; 25 1.7,0.25; 26 1.7,0.75; 27 1.7,1.25; 28 1.7,1.75 | smd 0.25 x 1: 2 0.75,2.4; 3 0.25,2.4; 4 -0.25,2.4; 5 -0.75,2.4; 16 -0.75,-2.4; 17 -0.25,-2.4; 18 0.25,-2.4; 19 0.75,-2.4
TSSOP24 = smd 0.305 x 0.991: 1 -3.575,-2.918; 2 -2.925,-2.918; 3 -2.275,-2.918; 4 -1.625,-2.918; 5 -0.975,-2.918; 6 -0.325,-2.918; 7 0.325,-2.918; 8 0.975,-2.918; 9 1.625,-2.918; 10 2.275,-2.918; 11 2.925,-2.918; 12 3.575,-2.918; 13 3.575,2.918; 14 2.925,2.918; 15 2.275,2.918; 16 1.625,2.918; 17 0.975,2.918; 18 0.325,2.918; 19 -0.325,2.918; 20 -0.975,2.918; 21 -1.625,2.918; 22 -2.275,2.918; 23 -2.925,2.918; 24 -3.575,2.918
QFN40P600X600X90-48_N = smd 0.65 x 0.2: 1 -3,2.2; 2 -3,1.8; 3 -3,1.4; 4 -3,1; 5 -3,0.6; 6 -3,0.2; 7 -3,-0.2; 8 -3,-0.6; 9 -3,-1; 10 -3,-1.4; 11 -3,-1.8; 12 -3,-2.2; 25 3,-2.2; 26 3,-1.8; 27 3,-1.4; 28 3,-1; 29 3,-0.6; 30 3,-0.2; 31 3,0.2; 32 3,0.6; 33 3,1; 34 3,1.4; 35 3,1.8; 36 3,2.2 | smd 0.2 x 0.65: 13 -2.2,-3; 14 -1.8,-3; 15 -1.4,-3; 16 -1,-3; 17 -0.6,-3; 18 -0.2,-3; 19 0.2,-3; 20 0.6,-3; 21 1,-3; 22 1.4,-3; 23 1.8,-3; 24 2.2,-3; 37 2.2,3; 38 1.8,3; 39 1.4,3; 40 1,3; 41 0.6,3; 42 0.2,3; 43 -0.2,3; 44 -0.6,3; 45 -1,3; 46 -1.4,3; 47 -1.8,3; 48 -2.2,3 | smd 4.7 x 4.7: PAD 0,0 | drill 0.4: PAD@VIA01 -1.8,1.8; PAD@VIA02 -1.8,0.6; PAD@VIA03 -1.8,-0.6; PAD@VIA04 -1.8,-1.8; PAD@VIA05 -0.6,1.8; PAD@VIA06 -0.6,0.6; PAD@VIA07 -0.6,-0.6; PAD@VIA08 -0.6,-1.8; PAD@VIA09 0.6,1.8; PAD@VIA10 0.6,0.6; PAD@VIA11 0.6,-0.6; PAD@VIA12 0.6,-1.8; PAD@VIA13 1.8,1.8; PAD@VIA14 1.8,0.6; PAD@VIA15 1.8,-0.6; PAD@VIA16 1.8,-1.8
XTRA_SMALL_JUMPER_3_NO = smd 0.305 x 0.61: 1 -0.813,0; 2 0,0; 3 0.813,0
TQFP64 = smd 0.22 x 1: 1 -3.75,-5.75; 2 -3.25,-5.75; 3 -2.75,-5.75; 4 -2.25,-5.75; 5 -1.75,-5.75; 6 -1.25,-5.75; 7 -0.75,-5.75; 8 -0.25,-5.75; 9 0.25,-5.75; 10 0.75,-5.75; 11 1.25,-5.75; 12 1.75,-5.75; 13 2.25,-5.75; 14 2.75,-5.75; 15 3.25,-5.75; 16 3.75,-5.75; 33 3.75,5.75; 34 3.25,5.75; 35 2.75,5.75; 36 2.25,5.75; 37 1.75,5.75; 38 1.25,5.75; 39 0.75,5.75; 40 0.25,5.75; 41 -0.25,5.75; 42 -0.75,5.75; 43 -1.25,5.75; 44 -1.75,5.75; 45 -2.25,5.75; 46 -2.75,5.75; 47 -3.25,5.75; 48 -3.75,5.75 | smd 1 x 0.22: 17 5.75,-3.75; 18 5.75,-3.25; 19 5.75,-2.75; 20 5.75,-2.25; 21 5.75,-1.75; 22 5.75,-1.25; 23 5.75,-0.75; 24 5.75,-0.25; 25 5.75,0.25; 26 5.75,0.75; 27 5.75,1.25; 28 5.75,1.75; 29 5.75,2.25; 30 5.75,2.75; 31 5.75,3.25; 32 5.75,3.75; 49 -5.75,3.75; 50 -5.75,3.25; 51 -5.75,2.75; 52 -5.75,2.25; 53 -5.75,1.75; 54 -5.75,1.25; 55 -5.75,0.75; 56 -5.75,0.25; 57 -5.75,-0.25; 58 -5.75,-0.75; 59 -5.75,-1.25; 60 -5.75,-1.75; 61 -5.75,-2.25; 62 -5.75,-2.75; 63 -5.75,-3.25; 64 -5.75,-3.75
2450AT18B100E = smd 1 x 1.6: P$1 -1.6,0; P$2 1.6,0
SOT23-6 = smd 0.55 x 1.2: 1 0.95,1.3; 2 0,1.3; 3 -0.95,1.3; 4 -0.95,-1.3; 5 0,-1.3; 6 0.95,-1.3
JST_SR/SZ_VERTICA_9POS = smd 0.6 x 1.55: 1 -4,-3.375; 2 -3,-3.375; 3 -2,-3.375; 4 -1,-3.375; 5 0,-3.375; 6 1,-3.375; 7 2,-3.375; 8 3,-3.375; 9 4,-3.375 | smd 1.2 x 1.8: M1 -5.3,-0.8; M2 5.3,-0.8
XTAL_3215_N = smd 1 x 1.8: 1 -1.25,0; 2 1.25,0
CRYSTAL-SMD-5X3.2-4PAD = smd 1.9 x 1.1: 1 -1.85,-1.15; 2 1.85,-1.15; 3 1.85,1.15; 4 -1.85,1.15
BT-XTAL_2016_N = smd 0.95 x 0.85: 1 -0.725,-0.575; 2 0.725,-0.575; 3 0.725,0.575; 4 -0.725,0.575
CRYSTAL-SMD-3.2X1.5MM = smd 1 x 1.8: P$1 -1.25,0; P$2 1.25,0

### Placement (x,y rotation side)
C1  37.82,28.59 90 top
C2  8.8,29.44 90 top
C3  32.76,25.41 180 top
C4  15.65,29.49 90 top
C5  10.26,25.64 180 top
C6  23.14,29.49 90 top
C7  17.86,25.53 180 top
C8  31.43,29.39 90 top
C9  4.2,26.5 90 top
C10  26.36,25.42 180 top
C11  15.99,15.81 270 top
C12  20.2,18.66 270 top
C13  21.6,18.7 90 top
C14  25.1,12.8 180 top
C15  5.7,21.5 180 top
C16  40.5,27.8 270 top
C17  44.7,5.1 90 top
C18  50,4.9 90 top
C19  50,7 0 top
C20  49.7,14 180 top
C21  44.6,18.9 0 top
C22  43.7,2.5 270 top
C23  35.5,19.8 180 top
C24  31.4,7 270 top
C25  33.4,18.1 270 top
C26  32.7,7 270 top
C27  42.6,2.5 270 top
C28  50.6,16.7 180 top
C29  47.6,17 180 top
C30  41.5,2.5 270 top
C31  47.6,15.9 180 top
C32  22.9,20 90 top
C33  29.2,20.6 90 top
C34  24.2,20 90 top
C35  2.1,3.3 270 top
C36  28.2,4.5 270 top
C37  27.9,11.8 180 bottom
C46  16.4,3 270 top
C47  12.4,3 90 top
C48  9.6,11.6 90 top
C49  17.6,3 270 top
C50  10.6,11.6 90 top
C51  11.9,5.6 270 top
C52  20,11.75 90 top
C53  21.3,6.5 270 top
C54  22.9,6.5 270 top
C55  18.8,3 90 top
C56  24,3 90 top
C57  10.6,6.3 270 top
C58  9.05,5.75 180 top
C59  10.6,2.1 270 top
J1  8,36.7 0 top
J2  17.1,36.7 0 top
J3  26.2,36.7 0 top
J4  35.3,36.7 0 top
J5  44.4,36.7 0 top
J6  51.5,30.3 270 top
L1  1.6,4.9 0 top
L2  2.1,6.5 270 top
L11  10.6,4.2 270 top
L12  21.5,8.9 180 top
L13  24.2,9 90 top
L14  10.6,8.4 270 top
L15  9.6,9.5 270 top
PH1  2,26.1 270 top
PH2  40.4,4.8 180 top
R1  33.34,26.24 90 bottom
R2  34.92,26.28 90 bottom
R3  4.01,26.51 90 bottom
R4  5.61,26.5 90 bottom
R5  11.07,26.44 90 bottom
R6  12.65,26.48 90 bottom
R7  18.36,26.34 90 bottom
R8  19.84,26.38 90 bottom
R9  25.95,26.24 90 bottom
R10  27.53,26.28 90 bottom
R11  20.17,18.56 270 bottom
R12  18.69,18.52 270 bottom
R13  27.9,12.8 0 top
R14  30.9,15.7 0 top
R15  5.7,19.8 180 top
R16  5.7,18.4 180 top
R17  5.7,17.1 180 top
R18  40.2,25.3 180 top
R19  40.2,24.2 180 top
R20  40.2,23 180 top
R21  10k  [R0402']  50.6,15.6 0 top
R22  10k  [R0402']  40,2.5 270 top
R23  1M  [R0402']  47.1,11.1 270 top
R24  22.6,15.7 90 top
R25  10k  [R0402']  39.1,19.8 180 top
R26  30.9,14.4 0 top
R27  30.9,13.2 0 top
R28  30.9,17.1 0 top
R29  30.9,18.4 0 top
U1  35.58,27.32 90 top
U2  6.35,27.57 90 top
U3  13.41,27.52 90 top
U4  20.7,27.42 90 top
U5  29.19,27.32 90 top
U6  18.03,17.48 270 top
U7  26.6,16 90 top
U8  10.9,18.6 0 top
U9  45.2,25.6 0 top
U11  16,8.8 180 top
U$5  7.4,18 90 bottom
U$6  8.7,18 90 bottom
U$9  39.3,12.6 90 top
U$10  2.1,9.8 90 top
U$12  28.2,8.2 0 top
U$13  28.5,0.4 180 bottom
X1  47.4,5 0 top
X2  49.7,10.5 90 top
X4  14.4,3 0 top
X5  21.4,3 0 top
Y1  26.7,20 180 top

### Tracks (layer width: path | path; a pad name or v marks a point on that pad's centre or on a via)
!BOOT
  Top 0.152: R24.1 23,15.2 23.55,15.75 U7.4
!RST
  Top 0.152: U7.11 26.85,13.35 R13.1
+OUT1
  Top 0.152: U2.P$7 6.79,30.81 6.5,31.1 J1.2
+OUT2
  Top 0.152: U3.P$7 13.85,30.75 13.3,31.3 13.3,33.9 13.6,34.2 15.2,34.2 15.6,33.8 J2.2
+OUT3
  Top 0.152: U4.P$7 21.14,33.24 21.7,33.8 23.8,33.8 24.4,33.2 24.4,31.9 24.5,31.8 24.5,31.2 24.5,31.73 J3.2
+OUT4
  Top 0.152: U5.P$7 29.63,30.93 29.9,31.2 29.9,33.3 30.6,34 32.6,34 33.8,32.8 J4.2
+OUT5
  Top 0.152: U1.P$7 36.02,28.42 35.7,28.1 35.7,27.3 36.1,26.9 38.4,26.9 38.9,27.39 38.9,29.73 39.57,30.41 42.3,30.41 42.9,31 J5.2
+OUT6  (via drill 0.35)
  Top 0.152: v24.5,5.3 25.2,6 25.2,10.3 v24.9,10.6 | U6.P$7 17.59,13.29 v17.5,13.2
  Bottom 0.152: v17.5,13.2 18.11,12.59 21.21,12.59 23.2,10.6 v24.9,10.6 | U$13.1 v24.5,5.3
-OUT1
  Top 0.152: U2.P$9 5.79,28.79 5.4,28.4 4.3,28.4 3.7,29 3.7,33.9 4.3,34.5 6.5,34.5 7.5,33.5 J1.3
-OUT2
  Top 0.152: U3.P$9 12.85,34.15 13.3,34.6 15.9,34.6 16.6,33.9 J2.3
-OUT3
  Top 0.152: U4.P$9 20.14,33.94 20.6,34.4 24.6,34.4 25.7,33.3 J3.3
-OUT4
  Top 0.152: J4.3 34.8,33.4 33.7,34.5 30.2,34.5 29.3,33.6 29.3,31.13 29.09,30.92 28.92,30.92 28.63,30.63 U5.P$9
-OUT5
  Top 0.152: U1.P$9 35.02,26.88 35.5,26.4 38.6,26.4 39.3,27.1 39.3,29.5 39.8,30 43.2,30 43.9,30.7 J5.3
-OUT6  (via drill 0.35)
  Top 0.152: v25.5,5.3 26,5.8 v26,10.6 | U6.P$9 v18.59,13.21 v18.6,13.2
  Bottom 0.152: v26,10.6 26,11.2 25.4,11.8 22.8,11.8 21.41,13.19 v18.61,13.19 v18.6,13.2 | U$13.2 v25.5,5.3
ADDR/MOSI
  Top 0.152: U7.17 30.35,15.75 R14.1
AVDD  (via drill 0.4 pad 0.8)
  Top 0.152: U11.36 U11.35
  Top 0.2: C54.1 22.95,7.35 24.05,8.45 L13.1 | U11.35 v13,5.8 12.25,5.8 C51.1
  Top 0.254: v24.1,6.8 23.55,7.35 22.95,7.35
  Bottom 0.4: v24.1,6.8 24,6.8 22.3,5.1 14.1,5.1 13.4,5.8 v13,5.8
BLE_RX
  Top 0.152: U11.11 19.04,10.64 22.44,10.64 23.64,11.85 U$9.42
BLE_TX
  Top 0.152: U11.10 22.6,10.2 23.75,11.35 U$9.43
CAP
  Top 0.152: U7.9 25.85,12.9 C14.1
EM_RX
  Top 0.152: U$9.16 46,17.3 46,20.1 46.29,20.39 47.05,20.39 47.66,21 49.5,21 50.1,21.59 50.1,23.7 51.5,25.1 J6.3
EM_TX
  Top 0.152: U$9.17 43.05,19.95 43.8,20.7 46.93,20.7 47.53,21.3 49.2,21.3 49.7,21.8 49.7,26 51.46,27.76 J6.2
EN1  (via drill 0.35 pad 0.04)
  Top 0.152: 7.29,25.61 v8.2,24.7 | U$9.33 34.75,16.35 v35,16.6
  Top 0.254: U2.P$5 7.29,25.61
  Bottom 0.152: v8.2,24.7 10.5,22.4 28.3,22.4 30,20.7 33,20.7 35,18.7 v35,16.6
EN2  (via drill 0.35 pad 0.04)
  Top 0.152: U3.P$5 14.69,25.61 v15.3,25 | v38.1,15.4 38.1,16.24 38.09,16.25 38.09,17.09 38.6,17.6 38.6,18.3 U$9.26
  Bottom 0.152: v15.3,25 17.2,23.11 28.8,23.11 30.4,21.5 37,21.5 38.01,20.49 38.01,16.25 38,16.24 38,15.5 v38.1,15.4
EN3  (via drill 0.35 pad 0.04)
  Top 0.152: U4.P$5 22.16,25 v22.4,25 | v39.4,15.4 39.4,16.24 39.39,16.25 39.39,17.29 39.6,17.5 39.6,18.3 U$9.24
  Bottom 0.152: v22.4,25 23.5,23.9 29.2,23.9 30.8,22.3 38.1,22.3 39.4,21 39.4,16.76 39.39,16.75 39.39,16.25 39.4,16.24 v39.4,15.4
EN4  (via drill 0.35 pad 0.04)
  Top 0.152: U5.P$5 30.13,24.87 30.3,24.7 30.8,24.7 v30.9,24.8 | v40.8,15.5 40.8,16.1 40.61,16.29 40.61,18.29 U$9.22
  Bottom 0.152: v30.9,24.8 31.7,24.8 33.51,22.99 36.65,22.99 36.66,23 39.4,23 40.8,21.6 40.8,17.2 40.8,16.66 40.79,16.65 40.79,16.15 40.8,16.14 v40.8,15.5
EN5  (via drill 0.35 pad 0.04)
  Top 0.152: U1.P$5 36.52,24.88 v37.1,24.3 | U$9.20 41.55,17.15 42.2,16.5 42.2,15.9 v41.8,15.5
  Bottom 0.152: v37.1,24.3 39.2,24.3 41.9,21.6 41.9,16.8 42.2,16.5 42.2,15.9 v41.8,15.5
EN6  (via drill 0.35, 0.35 pad 0.04)
  Top 0.152: U6.P$5 17.09,18.41 19.7,15.8 19.7,15.4 v21.3,13.8 | U$9.35 34.35,15.35 35.4,14.3 v36.7,14.3
  Top 0.254: v16.2,18.3 17.09,19.19 U6.P$5
  Bottom 0.152: v36.7,14.3 36.5,14.1 35.26,14.1 35.25,14.11 21.61,14.11 v21.3,13.8
GND  (via drill 0.35, 0.35 pad 0.04, 0.4 pad 0.8)
  Top 0.152: C51.2 12.15,4.8 v13.2,4.8
  Top 0.2: U11.PAD@VIA04 18.2,10.6 U11.13 | U11.34 14.2,7.4 U11.PAD@VIA13 | U11.33 13.8,7.8 U11.PAD@VIA14 | U11.PAD@VIA04 U11.PAD@VIA16 U11.PAD@VIA13 | U11.PAD@VIA04 U11.PAD@VIA01 U11.PAD@VIA13 | U11.PAD@VIA06 16,8.2 U11.PAD
  other vias: 14.5,17.1 18.2,16.4 11.5,2 8.3,7.9 9,1.3 8.2,0.7 8.3,4.5 23.1,17.9 21.2,15.8 6.4,14.7 1.8,13.3 8.3,6.8 8.3,11.2 0.8,13.3 12.3,14.4 26.4,16 8.3,10.1 8.3,9 14.9,33.5 22.4,33 30.9,33.1 31.9,33.3 4.4,30.6 4.4,33.5 11.4,30.8 8.1,27.2 6.4,28.5 41.5,26.5 45,25.9 32.4,16.6 15.2,13.9 23,12.5 43.8,9.9 43.8,11.3 43.8,8.7 42.9,4.1 42.1,4.5 7.2,0.7 6.2,0.7 5.2,0.7 4.2,0.7 3.1,0.7 7.5,3.9 6.7,3.4 5.7,3.4 4.5,3.4 3.5,5.6 4.7,5.6 3.5,3.7 3.5,4.6 0.7,3.7 1.1,1.7 0.7,2.7 8.3,12.3 7,12.3 7,11.3 7,10.2 7,9.1 7,7.9 7,6.8 7,5.7 5.9,5.6 1.9,0.9 29.4,2.2 30.4,2.2 31.5,2.2 31.5,0.9 30.4,0.9 29.3,0.9 35,1.9 33.7,2.7 32.5,2.2 33.7,3.6 32.7,5.2 35,0.9 30.1,6.8 28.4,2.2 30.3,7.8 29.2,5.7 29.9,10.7 28.8,10.7 37.9,12 39,13.3 38,8.9 36.6,8.9 36,12 45.8,2.8 47.4,2.8 45.8,1.5 47.4,1.5 45.2,17.6 45.2,20 52,14.2 52,13 48.4,6.8 51.8,6.7 6,22.7 9.9,17.1 10.8,20.2 32.4,19.5 31,26.4 33.5,28.4 51.1,32.6 52.1,33.1 52.1,32 50.1,31.2 50.1,28.3 31.5,5.2 32.5,0.9 11,28.6 15.2,26.9 15.9,26.2 18.5,28.5 22.6,26.9 23.2,26 26.1,28.5 27.3,28.5 22,31.9 14,33.2 5.5,33.5 6.5,33.5 1.8,31.9 1.8,30.7 1.8,29.6 1.8,28.3 3.8,13.3 1.1,14.9 2.9,13.3 1.1,16.6 2.6,16.6 2.6,14.9 42.8,35.6 44.3,35.6 43.5,34.2 36.4,35.6 33.2,35.6 34.8,35.6 37.8,35.6 37.9,34.2 41.7,34.2 51.8,5.6 51.8,4.5 52,11.9 52,10.5
  pour Top: 0.1,37 53.1,37 53.1,0 0.1,0
  pour Bottom: 0.1,37 53,37 53,0 0.1,0
  cutout Top: 18.2,11 18.2,6.6 13.8,6.6 13.8,11
IMU_SCL1  (via drill 0.35 pad 0.04)
  Top 0.152: J1.5 9.5,34.1 v9.3,34.3 | U9.20 44.23,29.12 v44.9,29.8
  Bottom 0.152: v44.9,29.8 10.4,29.8 9.3,30.9 v9.3,34.3
IMU_SCL2  (via drill 0.35 pad 0.04)
  Top 0.152: J2.5 18.6,34.2 v18.4,34.4 | U9.18 45.52,29.62 45.9,30 v46.3,30
  Bottom 0.152: v46.3,30 45.2,31.1 19.3,31.1 18.4,32 v18.4,34.4
IMU_SCL3  (via drill 0.35 pad 0.04)
  Top 0.152: J3.5 27.7,34.2 v27.6,34.3 | U9.16 46.83,29.62 47.5,30.3 v47.5,30.7
  Bottom 0.152: v47.5,30.7 45.9,32.3 28.1,32.3 27.6,32.8 v27.6,34.3
IMU_SCL4  (via drill 0.35 pad 0.04)
  Top 0.152: J4.5 36.8,34.1 v36.6,34.3 | U9.14 48.12,28.82 48.12,32.17 v47.8,32.5
  Bottom 0.152: v47.8,32.5 46.9,33.4 36.9,33.4 36.6,33.7 v36.6,34.3
IMU_SCL5  (via drill 0.35 pad 0.04)
  Top 0.152: J5.5 45.9,34 v46.5,34.6 | U9.11 48.12,24.12 v48.5,24.5
  Bottom 0.152: v46.5,34.6 47.4,34.6 49.4,32.6 49.4,25.4 v48.5,24.5
IMU_SCL6  (via drill 0.35)
  Top 0.152: U7.19 29.6,16.75 | 29.6,16.75 30.05,16.75 R28.1 | v29.6,17.7 29.6,16.75 | v31.3,19.4 32.9,21 46,21 46.83,21.82 U9.9
  Bottom 0.152: v31.3,19.4 v29.6,17.7
IMU_SCL7  (via drill 0.35)
  Top 0.152: U9.7 45.52,23.62 v46.4,24.5
  Bottom 0.152: v46.4,24.5 46.6,24.3 46.6,8.9 44.3,6.6 31.7,6.6 30.5,5.4 U$13.7
IMU_SDA1  (via drill 0.35 pad 0.04)
  Top 0.152: J1.4 8.5,34 v8.2,34.3 | v44.8,26.8 44.77,26.82 44.88,26.93 U9.19
  Bottom 0.152: v8.2,34.3 8.2,31.2 10.1,29.3 42.4,29.3 44.8,26.9 v44.8,26.8
IMU_SDA2  (via drill 0.35 pad 0.04)
  Top 0.152: J2.4 17.6,34.1 v17.3,34.4 | U9.17 46.17,27.07 v45.9,26.8
  Bottom 0.152: v17.3,34.4 17.3,31.2 18,30.5 45.1,30.5 45.7,29.9 45.7,27 v45.9,26.8
IMU_SDA3  (via drill 0.35 pad 0.04)
  Top 0.152: J3.4 26.7,34.1 v26.5,34.3 | U9.15 47.48,27.38 v46.9,26.8
  Bottom 0.152: v26.5,34.3 26.5,32.1 26.9,31.7 45.6,31.7 47,30.3 47,26.9 v46.9,26.8
IMU_SDA4  (via drill 0.35 pad 0.04)
  Top 0.152: J4.4 35.8,34 v35.5,34.3 | U9.13 48.77,27.27 v47.7,26.2
  Bottom 0.152: v35.5,34.3 35.5,33.5 36.1,32.9 46.2,32.9 48.11,30.99 48.11,26.61 v47.7,26.2
IMU_SDA5  (via drill 0.35 pad 0.04)
  Top 0.152: J5.4 44.9,34 v45.2,34.3 | U9.10 47.48,24.68 v48.2,25.4
  Bottom 0.152: v48.2,25.4 48.8,26 48.8,32.4 47.3,33.9 46.2,33.9 45.8,34.3 v45.2,34.3
IMU_SDA6
  Top 0.152: U7.20 28.85,18.25 29,18.4 R29.1 30.4,19.8 32,21.4 45.7,21.4 46.2,21.9 46.17,21.93 U9.8
IMU_SDA7  (via drill 0.35)
  Top 0.152: U9.6 44.88,23.98 v45.4,24.5
  Bottom 0.152: v45.4,24.5 46,23.9 46,9.2 43.9,7.1 31.5,7.1 29.6,5.2 29.6,3.88 U$13.6
IN  (via drill 0.35)
  Top 0.152: v27.5,8.1 27.25,8.35 U$12.3 27.2,9.55 v27.2,10.7
  Bottom 0.152: v27.5,8.1 27.5,5.8 28.5,4.8 U$13.5 | C37.1 27.2,11.75 v27.2,10.7
IN/TRIG1  (via drill 0.35)
  Top 0.152: U2.P$4 6.79,24.51 v7.3,24 | U$9.34 34.85,15.85 v35.1,15.6
  Bottom 0.152: v7.3,24 9.3,22 28,22 29.7,20.3 32.7,20.3 34.3,18.7 34.3,16.4 v35.1,15.6
IN/TRIG2  (via drill 0.35)
  Top 0.152: U3.P$4 13.85,24.75 v14.3,24.3 | v37.4,16.5 37.4,17 38.1,17.7 38.1,18.3 U$9.27
  Bottom 0.152: v14.3,24.3 15.8,22.8 28.5,22.8 30.2,21.1 36.8,21.1 37.4,20.5 v37.4,16.5
IN/TRIG3  (via drill 0.35)
  Top 0.152: U4.P$4 21.14,24.36 v21.4,24.1 | U$9.25 39.05,16.85 v38.7,16.5
  Bottom 0.152: v21.4,24.1 22,23.5 29,23.5 30.61,21.89 37.7,21.89 38.99,20.6 38.99,16.8 v38.7,16.5
IN/TRIG4  (via drill 0.35)
  Top 0.152: U5.P$4 29.63,24.17 30,23.8 v30.5,23.8 | U$9.23 40.05,16.55 v40,16.5
  Bottom 0.152: v30.5,23.8 32.2,23.8 33.4,22.6 38.7,22.6 40.3,21 40.3,16.8 v40,16.5
IN/TRIG5  (via drill 0.35)
  Top 0.152: U1.P$4 36.02,23.78 v36.2,23.6 | U$9.21 41.05,16.75 v41.4,16.4
  Bottom 0.152: v36.2,23.6 39.3,23.6 41.4,21.5 v41.4,16.4
IN/TRIG6  (via drill 0.35)
  Top 0.152: U6.P$4 17.59,18.41 22.5,13.5 v23,13.5 | U$9.36 34.35,14.85 35.4,13.8 v35.4,13.4
  Bottom 0.152: v35.4,13.4 35.1,13.7 23.2,13.7 v23,13.5
INPUTSCL  (via drill 0.35)
  Top 0.152: U8.22 8.62,19.77 v9.8,18.6 9.6,18.4 R16.1 | v36.7,15.3 36.7,15.84 36.71,15.85 36.71,16.35 36.7,16.36 36.7,17 37.05,17.35 U$9.29
  Bottom 0.152: v9.8,18.6 13.8,14.6 36,14.6 v36.7,15.3
INPUTSCL1  (via drill 0.35)
  Top 0.152: U$9.58 40.05,8.25 v39.8,8.5 | R19.1 41,24.2 v43,26.2 42.92,26.27 U9.22
  Bottom 0.152: v39.8,8.5 44.4,13.1 44.4,24.8 v43,26.2
INPUTSDA  (via drill 0.35)
  Top 0.152: U$9.30 36.55,17.55 36.1,17.1 v36.1,16.1 | U8.23 7.97,19.82 v8,19.8 R15.1
  Bottom 0.152: v8,19.8 10.3,19.8 15.11,14.99 35.59,14.99 36.09,15.5 36.09,15.55 36.1,15.56 v36.1,16.1
INPUTSDA1  (via drill 0.35)
  Top 0.152: v40.5,10.3 40.55,10.25 U$9.59 | R18.1 41.15,25.29 42.3,26.44 v42.3,27.1 42.3,28.49 U9.23
  Bottom 0.152: v40.5,10.3 43.8,13.6 43.8,24.3 42.3,25.8 v42.3,27.1
N$1
  Top 0.254: U1.P$1 C3.1
N$2
  Top 0.152: U$9.28 37.55,19.3 38.05,19.8 R25.2
N$3
  Top 0.152: U$9.60 41.05,5.95 41.4,5.6 41.4,4.55 R22.1
N$4
  Top 0.152: C12.1 19.91,19.39 20.02,19.39
  Top 0.254: 20.02,19.39 U6.P$1
N$5
  Top 0.152: C23.1 36.15,18.45 U$9.31
N$6
  Top 0.254: U$9.47 32.85,9.35 31.4,7.9 C24.1
N$7
  Top 0.152: C34.1 25.2,19.35 25.35,19.5 | Y1.P$2 25.45,19.6 25.38,19.52 25.35,19.5 | U7.27 25.35,19.5
N$10
  Top 0.254: C9.1 4.2,25.75 4.29,25.66 U2.P$1
N$13
  Top 0.254: U3.P$1 10.94,25.61 C5.1
N$14
  Top 0.152: Y1.P$1 28.05,20 28.12,19.93 | 28.12,19.93 28.3,19.75 28.7,19.75 28.9,19.95 C33.1 | U7.26 25.85,18.25 27.52,19.93 28.12,19.93
N$15
  Top 0.406: L2.2 2.15,5.9 L1.2 2.1,4.85 C35.1
N$16
  Top 0.254: C7.1 19.62,25.53 U4.P$1
N$17
  Top 1: U$10.P$1 L2.1
N$19
  Top 0.254: U5.P$1 C10.1
N$27  (via drill 0.35 pad 0.04)
  Top 0.152: v6.4,15.7 6.42,15.68 U8.1
  Bottom 0.152: U$5.2 6.9,18 6.4,17.5 v6.4,15.7
N$30  (via drill 0.35 pad 0.04)
  Top 0.152: v7.9,14.6 7.97,14.68 U8.2
  Bottom 0.152: U$6.2 8.3,18 8.1,17.8 8.1,14.8 v7.9,14.6
N$33
  Top 0.152: U11.38 14.2,5.1 15.12,4.17 X4.3
  Top 0.2: C46.1 15.15,3.55 X4.3
N$34
  Top 0.2: L13.2 22.95,9.55 L12.1
N$35
  Top 0.152: L12.2 19.9,8.1 19.9,7.5 19.4,7 U11.2
N$36
  Top 0.2: U11.29 11.9,9.4 10.6,10.7 C50.1
N$37
  Top 0.152: C49.1 16.15,5 15,5 14.6,5.4 U11.39
N$38
  Top 0.2: U11.31 10.95,8.6 L14.1 L15.2
N$39
  Top 0.2: C48.1 L15.1 10.65,10.05 11.7,9 12,9 U11.30
N$40
  Top 0.2: U11.32 10.95,8.2 L14.2 C57.1
N$41
  Top 0.2: C58.1 C57.2 L11.1
P0.26/XL2
  Top 0.152: U11.45 17,4.8 17.5,4.3 19.5,4.3 20.07,3.73 20.07,3.2 | 20.07,3.2 20.07,3.08 | C55.2 19.15,3.2 20.07,3.2
  Top 0.2: X5.1 20.07,3.08
P0.27/XL1
  Top 0.152: X5.2 22.65,3.65 21.6,4.7 17.9,4.7 17.4,5.2 U11.46
  Top 0.2: C56.2 22.65,3.55 X5.2
PC14
  Top 0.152: X1.1 46.23,5.08
  Top 0.254: C17.2 45.65,5.65 46.05,5.25 | 46.23,5.08 46.05,5.25 | U$9.3 45.75,9.85 46.4,9.2 46.4,5.6 46.05,5.25
PC15
  Top 0.152: X1.2 48.65,5.35 48.6,5.4
  Top 0.254: C18.2 48.65,5.45 48.6,5.4 | U$9.4 45.95,10.35 47.5,8.8 47.5,6 48.5,5 X1.2
PH0
  Top 0.254: U$9.5 46.7,10.85 R23.2 49.05,10.45 X2.1 50.85,7.3 C19.2
PH1
  Top 0.254: 49.15,12.95 49.15,13 | 49.15,13 C20.2 | 49.15,12.95 X2.3 47.7,12.35 R23.1 46.7,11.35 U$9.6 | 49.15,12.95 49.15,13
Q
  Top 0.152: U$12.1 29.9,9.5 31.11,10.71 31.99,10.71 32.3,10.4 33.5,10.4 U$9.45
RESET
  Top 0.152: U8.3 8.62,16.57 8.1,17.1 R17.1
RESET1
  Top 0.152: U9.3 42.92,23.57 42.5,24 41.7,24 R20.1
RF
  Top 0.152: 2.15,2.75 C35.2
  Top 0.2: L11.2 10.4,3.1 C59.1
  Top 1: 2.15,2.75 2.9,2 7.7,2 8.8,3.1 10.4,3.1
RST  (via drill 0.35)
  Top 0.152: U$9.7 45.95,11.85 46.3,12.2 46.3,13.8 46.7,14.2 v48.1,14.2 48.7,14.8 51,14.8 51.25,15.05 R21.2
  Top 0.254: C28.1 R21.2
  Bottom 0.152: PH2.1 41.6,6 44.6,6 47.2,8.6 47.2,13.6 47.8,14.2 v48.1,14.2
S_SCL
  Top 0.152: U7.15 29.95,13.2 R27.1
S_SDA
  Top 0.152: U7.16 29.85,14.4 R26.1
SCL1  (via drill 0.35 pad 0.04)
  Top 0.152: U8.20 9.93,22.27 9.4,22.8 7.07,22.8 6.47,23.4 5.2,23.4 v4.2,24.4 5.4,24.4 5.79,24.79 U2.P$2
  Bottom 0.254: R3.1 4.01,24.59 v4.2,24.4
SCL2  (via drill 0.35 pad 0.04)
  Top 0.152: U8.18 11.22,24.27 v11,24.5 12.5,24.5 12.85,24.85 U3.P$2
  Bottom 0.254: R5.1 11.07,24.57 v11,24.5
SCL3  (via drill 0.35 pad 0.04)
  Top 0.152: U8.16 12.53,22.52 13.4,23.4 17.3,23.4 v18.3,24.4 19.8,24.4 20.14,24.74 U4.P$2
  Bottom 0.152: R7.1 18.3,25.43 v18.3,24.4
SCL4  (via drill 0.35 pad 0.04)
  Top 0.152: U8.14 13.82,22.43 14,22.6 17.7,22.6 18.3,23.2 21.9,23.2 24,25.3 v24.4,25.3 24.4,24.9 25.1,24.2 28.3,24.2 28.63,24.53 U5.P$2
  Bottom 0.152: v24.4,25.3 25.86,25.3 R9.1
SCL5  (via drill 0.35 pad 0.04)
  Top 0.152: U8.11 13.82,18.32 14.9,19.4 14.9,21.1 15.6,21.8 18.2,21.8 18.7,22.3 22.3,22.3 23,23 27,23 31.2,23 32.4,24.2 v33.5,24.2 34.5,24.2 34.9,24.59 34.9,24.6 35.02,24.72 U1.P$2
  Bottom 0.254: R1.1 33.5,25.23 v33.5,24.2
SCL6  (via drill 0.35, 0.35 pad 0.04)
  Top 0.152: U6.P$2 18.59,20.09 19.1,20.6 19.9,20.6 v20,20.7 | U8.9 12.53,19.48 v11.8,20.2
  Bottom 0.152: R11.1 20.17,20.53 v20,20.7 19.69,21.01 12.61,21.01 v11.8,20.2
SDA1  (via drill 0.35 pad 0.04)
  Top 0.152: U8.19 10.57,22.32 9.8,23.1 7.2,23.1 v6.2,24.1 6.29,24.19 U2.P$3
  Bottom 0.152: R4.1 5.61,24.69 v6.2,24.1
SDA2  (via drill 0.35 pad 0.04)
  Top 0.152: U8.17 11.88,22.98 v13.2,24.3 13.35,24.45 U3.P$3
  Bottom 0.152: R6.1 12.65,24.85 v13.2,24.3
SDA3  (via drill 0.35 pad 0.04)
  Top 0.152: U8.15 13.18,22.48 13.7,23 17.43,23 18.22,23.79 20.09,23.79 v20.4,24.1 20.64,24.34 U4.P$3
  Bottom 0.152: R8.1 20.4,24.97 v20.4,24.1
SDA4  (via drill 0.35 pad 0.04)
  Top 0.152: U8.13 14.47,21.82 14.86,22.2 18,22.2 18.6,22.8 22.1,22.8 22.8,23.5 28.4,23.5 29.13,24.23 U5.P$3 29.13,26.87 v29,27
  Bottom 0.152: R10.1 28.43,25.43 29,26 v29,27
SDA5  (via drill 0.35 pad 0.04)
  Top 0.152: U8.10 13.18,14.93 13.7,14.4 14.6,14.4 15.3,15.1 15.3,20.8 15.9,21.4 18.44,21.4 18.84,21.8 22.5,21.8 23.2,22.5 31.9,22.5 32.8,23.4 34.6,23.4 v35.2,24 35.52,24.32 U1.P$3
  Bottom 0.152: R2.1 35.2,25.15 v35.2,24
SDA6  (via drill 0.35, 0.35 pad 0.04)
  Top 0.152: U8.8 11.88,19.18 v11.9,19.2 | v16.3,20.4 17.9,20.4 18.1,20.2 18.09,20.19 U6.P$3
  Bottom 0.152: R12.1 18.69,20.11 18.4,20.4 v16.3,20.4 13.1,20.4 v11.9,19.2
SWDCLK
  Top 0.152: U11.24 13.8,12.5 13,13.3 6.7,13.3 6.7,13.29 5.17,13.29 4,14.47 4,21.96 2.4,23.56 PH1.3
SWDIO/NRESET
  Top 0.152: U11.23 14.23,11.83 14.23,12.5 13.03,13.71 6.67,13.71 6.67,13.7 5.2,13.7 4.3,14.6 4.3,22.6 3,23.9 3,24.4 2.57,24.83 PH1.2
TCK
  Top 0.152: U$9.49 35.55,5.03 PH2.5
TDI
  Top 0.152: PH2.4 36.05,5.36 U$9.50
TDO
  Top 0.152: U$9.55 38.55,5.49 PH2.3
TMS
  Top 0.152: U$9.46 34.65,9.85 35.3,9.2 35.3,8.5 34.05,7.25 PH2.6
TRST
  Top 0.152: U$9.56 39.05,4.88 PH2.2
VCC  (via drill 0.35 pad 0.04, 0.4 pad 0.8)
  Top 0.152: C32.1 23.65,18.6 24.6,18.6 24.85,18.35 U7.28 | C31.1 48.55,15.6 R21.1 | 41.62,29.12 U9.24
  Top 0.254: 30.13,28.81 U5.P$6 | U4.P$6 21.64,28.04 | 21.64,28.04 v21.6,28 | U2.P$6 7.29,28.81 v7.8,28.3 8.24,28.3 C2.1 | U8.24 7.31,21.5 C15.1 6.35,21.35 5.2,20.2 5.2,19.7 | R15.2 5.2,19.7 | 5.2,19.7 R16.2 R17.2 5.3,17 v5.3,15.7 | 30.13,28.81 C8.1 | C1.1 37.61,27.8 v36.4,27.8 36.52,27.92 U1.P$6 37.8,31.09 J4.6 | C11.1 16.6,17 v17.2,17 16.7,17 17.09,16.61 U6.P$6 17.09,14.49 v16.5,13.9 | J1.6 11.38,31.93 12.35,30.95 U3.P$10 10.71,30.02 9.8,29.1 v9.8,27 | U2.P$10 5.29,29.59 5,29.3 v4.5,29.3 | 30.13,28.81 30.13,27.97 v30.3,27.8 | C29.1 48.25,16.6 | 48.25,16.6 C31.1 | C30.1 42,3.15 C27.1 C22.1 43.7,6.2 U$9.64 | U$9.64 43.75,6.85 45.05,8.15 U$9.1 | U$9.19 42.05,17.25 42.4,16.9 42.9,16.9 | 42.9,16.9 43.95,16.9 C21.1 | C26.1 32.7,8 U$9.48 34.55,8.85 v34.6,8.9 | U6.P$10 19.09,14.11 19.3,13.9 v19.7,13.9 | U$9.32 33.8,18.35 C25.1 31.75,18.75 R29.2 R28.2 R14.2 R26.2 R27.2 31.4,12.7 | U11.1 20,6.6 v20.1,6.7 20.7,7.3 C53.1 | v17,27.2 17,29.3 17.61,29.91 U4.P$10 19.64,31.89 J2.6 | U3.P$6 14.35,28.15 | 14.35,28.15 v14.3,28.1 | C4.1 14.89,28.15 14.35,28.15 | v24.7,27.2 24.7,28.7 25.82,29.82 U5.P$10 28.13,30.86 28.7,31.43 J3.6 | U1.P$10 33.41,29.82 32.5,28.9 32.5,27.5 v32.1,27.1 | 41.62,29.12 42.1,29.6 43.7,29.6 44.8,30.7 46.2,30.7 46.8,31.3 46.8,31.82 J5.6 46.9,33.1 47.5,33.7 48.7,33.7 51.5,30.9 J6.1 | 31.4,12.7 31.4,12.6 31.1,12.3 29.4,12.3 28.9,12.8 R13.2 | v32.3,12.7 31.4,12.7 | U7.28 24.85,17.15 25.1,16.9 25.1,16.5 24.85,16.25 U7.3 22.65,16.25 | v21.4,16.9 21.4,17.85 C13.1 22.65,17 22.65,16.25 | 42.9,14.9 v42.9,14.8 43.05,14.65 U$9.64 | 42.9,14.9 42.9,16.9 | 42.9,14.9 42.95,14.85 U$9.13 47.85,14.85 48.35,15.35 48.35,16.5 48.25,16.6
  Top 0.254: U11.12 19.8,11 C52.1 20.9,11.2 v21,11.3 | v38.6,25.7 39.3,25.7 | 39.3,25.7 R18.2 R19.2 R20.2 | U9.24 40.57,28.52 C16.1 39.95,28.45 39.66,28.16 39.66,26.06 39.3,25.7 | 21.64,28.04 22.27,28.04 C6.1 | 22.65,16.25 R24.2 | v31.5,10.1 29.5,8.1 28.6,8.1 28.2,7.7 U$12.5 28.2,6 C36.1
  Bottom 0.152: U$5.3 U$6.3
  Bottom 0.254: 4.5,27.36 R4.2 6.85,27.35 v7.8,28.3 | 4.5,27.36 R3.2 | 11.11,27.33 R5.2 | 25.99,27.13 R9.2 | v4.5,29.3 4.5,27.36 | R7.2 | v17.2,17 17.2,17.3 18.32,17.3 R12.2 18.73,17.71 R11.2 20.98,16.9 v21.4,16.9 | U$5.3 7.2,18.81 | 7.2,18.81 6.61,18.81 5.3,17.5 v5.3,15.7 | v34.6,8.9 34.6,10.1 | 16.3,11.6 16.2,11.7 16.2,13.6 v16.5,13.9 v19.7,13.9 | PH1.4 4.81,22.29 7.34,19.76 7.34,18.95 7.2,18.81
  Bottom 0.4: v21,11.3 21,9.4 21,7.6 v20.1,6.7
  Bottom 0.406: v7.8,28.3 8.1,28 9.1,28 9.8,27.3 v9.8,27 10.13,27.33 11.11,27.33 R6.2 13.42,28.1 v14.3,28.1 16.1,28.1 v17,27.2 R7.2 | R7.2 18.4,27.23 R8.2 20.61,28 v21.6,28 23.9,28 v24.7,27.2 24.77,27.13 25.99,27.13 | R9.2 27.49,27.09 R10.2 28.2,27.8 v30.3,27.8 31.4,27.8 v32.1,27.1 v32.11,27.09 R1.2 33.38,27.13 R2.2 35.59,27.8 v36.4,27.8 37.9,27.8 38.6,27.1 v38.6,25.7 42.9,21.4 v42.9,14.8 38.2,10.1 35.6,10.1 34.6,10.1 32.3,10.1 | 32.3,10.1 v31.5,10.1 30.6,9.2 26.5,9.2 21.2,9.2 21,9.4 | v32.3,12.7 32.3,10.1 | v21,11.3 20.7,11.6 16.3,11.6 13.4,11.6 11.2,13.8 5.9,13.8 5.3,14.4 v5.3,15.7
  Bottom 0.61: 26.5,9.2 U$13.3 U$13.4
X2
  Top 0.152: U11.37 13.87,5.73 13.87,5 14.4,4.47 14.4,3.08 13.77,2.45 13.65,2.45
  Top 0.2: C47.1 13.65,2.45 X4.1